# EAGLE schematic main (EAGLE 9.4.2), part 1 of 2

## Sheet 1 of 11: Clock & Power
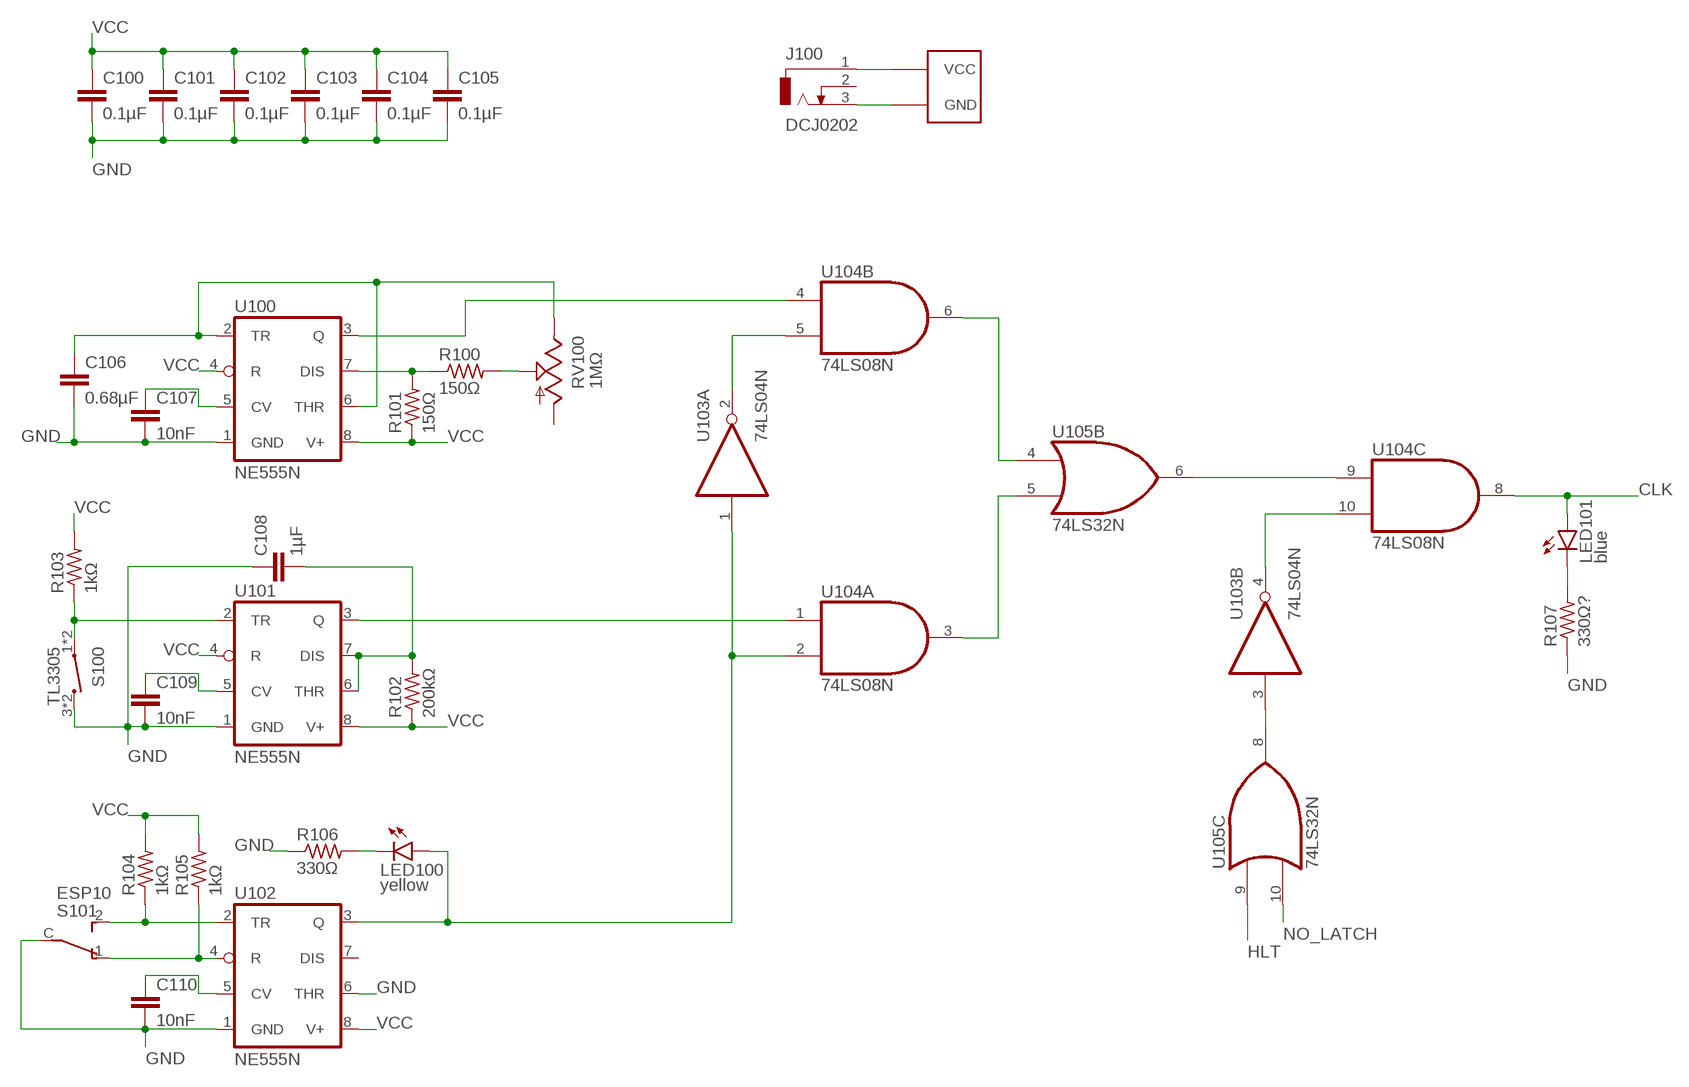
[diagram p0: schematic, sheet 1]

### Parts
C100  0.1µF  C-EUC0805K  [C0805K]
C101  0.1µF  C-EUC0805K  [C0805K]
C102  0.1µF  C-EUC0805K  [C0805K]
C103  0.1µF  C-EUC0805K  [C0805K]
C104  0.1µF  C-EUC0805K  [C0805K]
C105  0.1µF  C-EUC0805K  [C0805K]
C106  0.68µF  C-EUC0805K  [C0805K]
C107  10nF  C-EUC0805K  [C0805K]
C108  1µF  C-EUC0805K  [C0805K]
C109  10nF  C-EUC0805K  [C0805K]
C110  10nF  C-EUC0805K  [C0805K]
J100  DCJ0202  [DCJ0202]
LED100  yellow  LED3MM  [LED3MM]
LED101  blue  LED3MM  [LED3MM]
R100  150Ω  R-US_R0805  [R0805]
R101  150Ω  R-US_R0805  [R0805]
R102  200kΩ  R-US_R0805  [R0805]
R103  1kΩ  R-US_R0805  [R0805]
R104  1kΩ  R-US_R0805  [R0805]
R105  1kΩ  R-US_R0805  [R0805]
R106  330Ω  R-US_R0805  [R0805]
R107  330Ω?  R-US_R0805  [R0805]
RV100  1MΩ  TRIM_US-CA9V  [CA9V]
S100  TL3305  [TL3305_MICROSWITCH]
S101  ESP10  [ESP10]
U100  NE555N  [DIL08]
U101  NE555N  [DIL08]
U102  NE555N  [DIL08]
U103  74LS04N  [DIL14]
U104  74LS08N  [DIL14]
U105  74LS32N  [DIL14]

### Nets
!CLK_ENABLE: U103.3(B:I) U105.8(C:O)
!CLK_SWITCH: U103.2(A:O) U104.5(B:I1)
CLK: LED101.A U104.8(C:O) ; also sheet 2,3,4,5,6,7,9,10,11
CLK_AUTO: U104.6(B:O) U105.4(B:I0)
CLK_AUTO_RAW: U100.3(Q) U104.4(B:I0)
CLK_ENABLE: U103.4(B:O) U104.10(C:I1)
CLK_MANUAL: U104.3(A:O) U105.5(B:I1)
CLK_MANUAL_RAW: U101.3(Q) U104.1(A:I0)
CLK_RAW: U104.9(C:I0) U105.6(B:O)
CLK_SWITCH: LED100.A U102.3(Q) U103.1(A:I) U104.2(A:I1)
GND: C100.2 C101.2 C102.2 C103.2 C104.2 C105.2 C106.2 C107.2 C108.1 C109.2 C110.2 J100.3 R106.1 R107.1 S100.3 S100.4 S101.C(P) U100.1(GND) U101.1(GND) U102.1(GND) U102.6(THR) ; supply symbol labelled SUPPLY ; also sheet 2,3,4,5,6,7,8,9,10,11
HLT: U105.9(C:I0) ; also sheet 11
LED100_GND: LED100.K(C) R106.2
LED101_GND: LED101.K(C) R107.2
NO_LATCH: U105.10(C:I1) ; also sheet 5
U100_CAP: C106.1 RV100.E U100.2(TR) U100.6(THR)
U100_CV: C107.1 U100.5(CV)
U100_DIS: R100.1 R101.2 U100.7(DIS)
U100_DIS_INT: R100.2 RV100.S
U101_CAP: C108.2 R102.2 U101.6(THR) U101.7(DIS)
U101_CV: C109.1 U101.5(CV)
U101_TR: R103.1 S100.1 S100.2 U101.2(TR)
U102_CV: C110.1 U102.5(CV)
U102_R: R105.1 S101.1(O) U102.4(R)
U102_TR: R104.1 S101.2(S) U102.2(TR)
VCC: C100.1 C101.1 C102.1 C103.1 C104.1 C105.1 J100.1 R101.1 R102.1 R103.2 R104.2 R105.2 U100.4(R) U100.8(V+) U101.4(R) U101.8(V+) U102.8(V+) ; supply symbol labelled SUPPLY ; also sheet 2,3,4,5,6,7,8,9,10,11
Unconnected: J100.2 RV100.A U102.7(DIS) U103.5(C:I) U103.6(C:O) U103.12(F:O) U103.13(F:I) U104.11(D:O) U104.12(D:I0) U104.13(D:I1)

## Sheet 2 of 11: RAM & Z Register
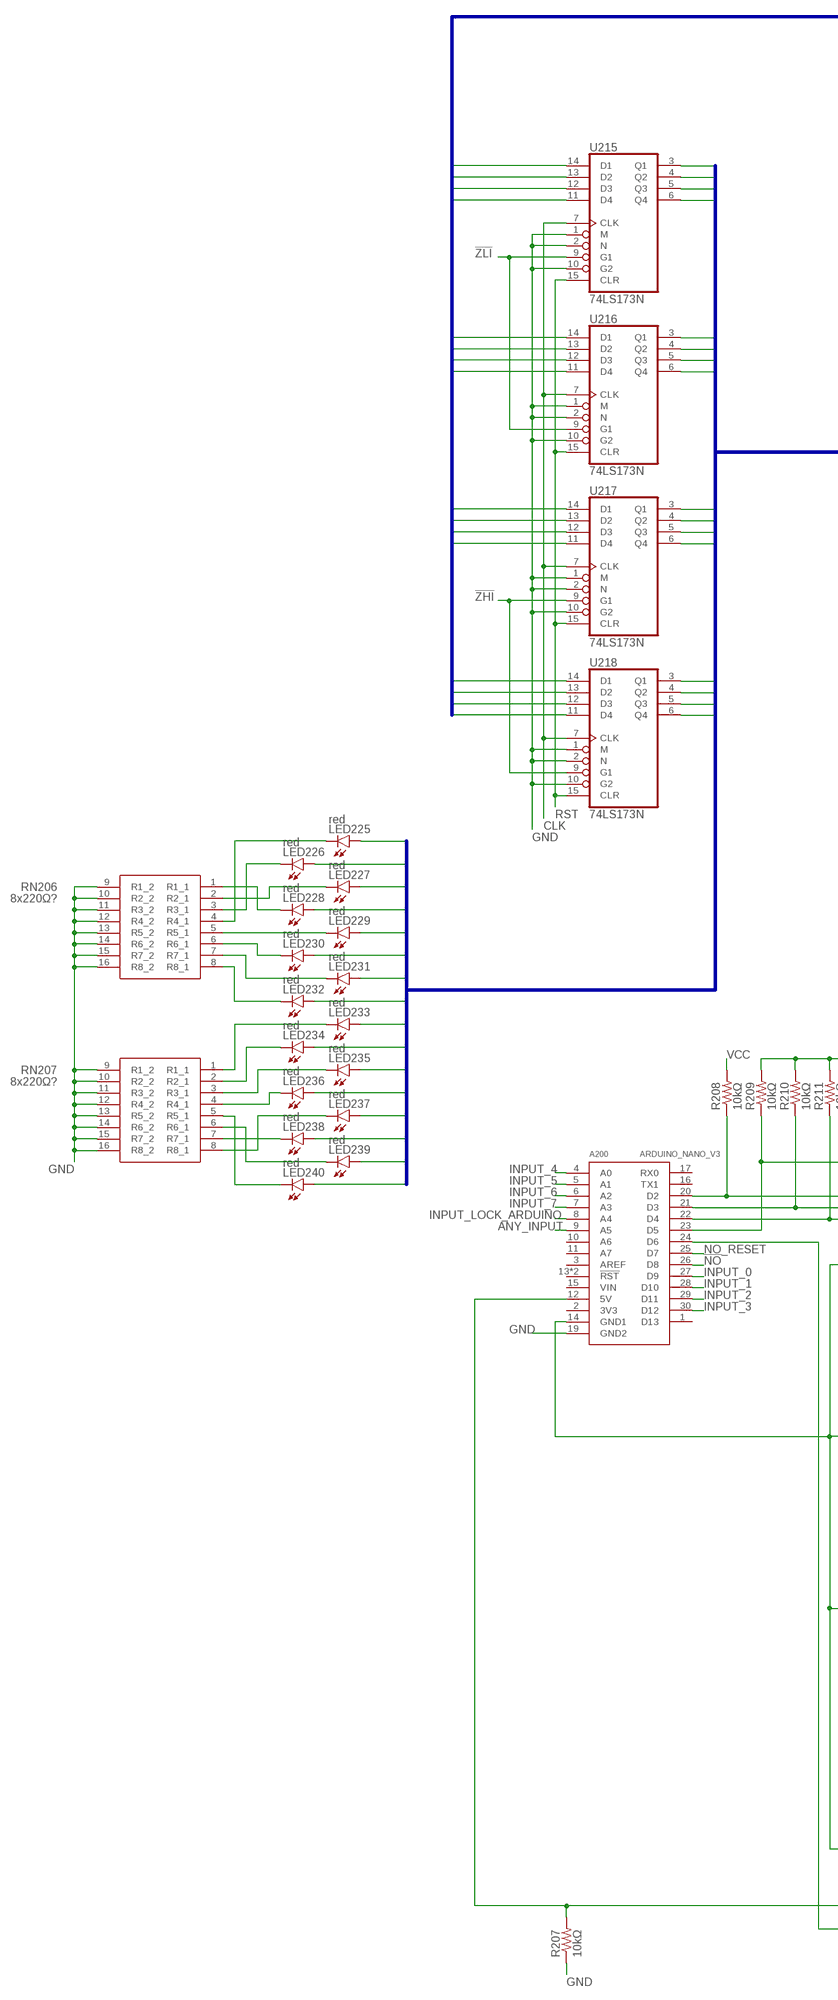
[diagram p1: schematic, sheet 2, part 1 of 2]
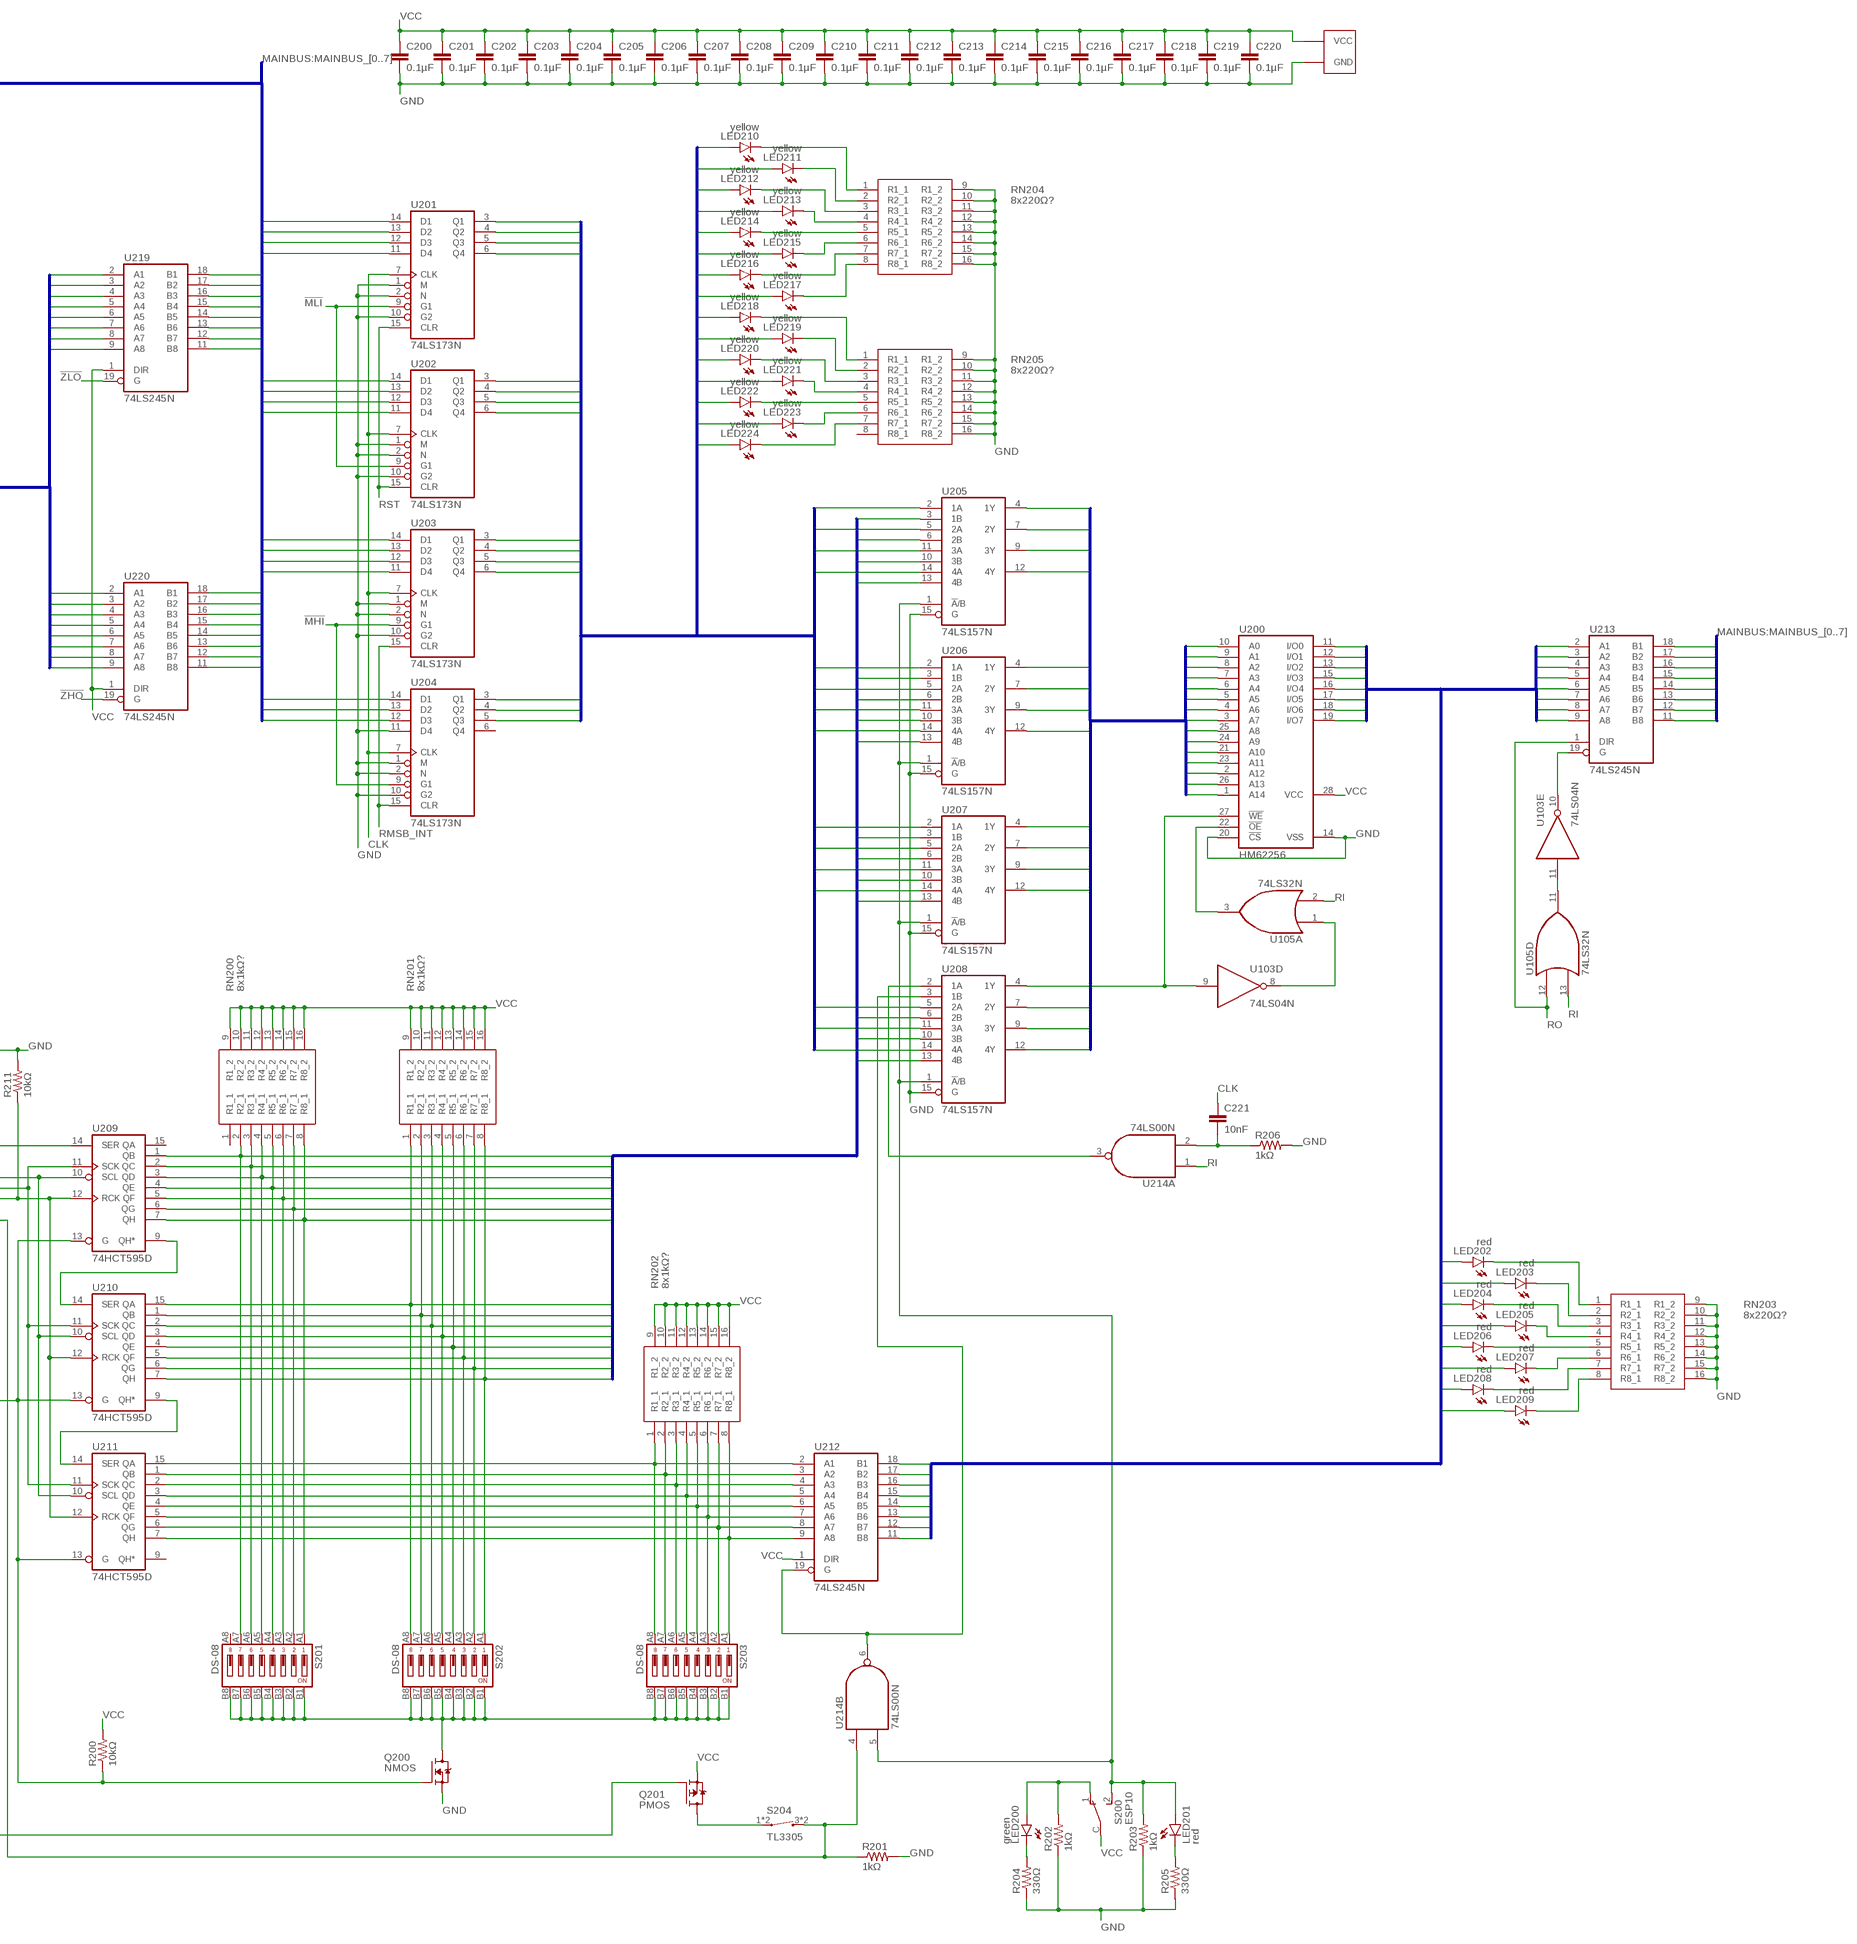
[diagram p2: schematic, sheet 2, part 2 of 2]

### Parts
A200  ARDUINO_NANO_V3  [ARDUINO_NANO_V3]
C200  0.1µF  C-EUC0805K  [C0805K]
C201  0.1µF  C-EUC0805K  [C0805K]
C202  0.1µF  C-EUC0805K  [C0805K]
C203  0.1µF  C-EUC0805K  [C0805K]
C204  0.1µF  C-EUC0805K  [C0805K]
C205  0.1µF  C-EUC0805K  [C0805K]
C206  0.1µF  C-EUC0805K  [C0805K]
C207  0.1µF  C-EUC0805K  [C0805K]
C208  0.1µF  C-EUC0805K  [C0805K]
C209  0.1µF  C-EUC0805K  [C0805K]
C210  0.1µF  C-EUC0805K  [C0805K]
C211  0.1µF  C-EUC0805K  [C0805K]
C212  0.1µF  C-EUC0805K  [C0805K]
C213  0.1µF  C-EUC0805K  [C0805K]
C214  0.1µF  C-EUC0805K  [C0805K]
C215  0.1µF  C-EUC0805K  [C0805K]
C216  0.1µF  C-EUC0805K  [C0805K]
C217  0.1µF  C-EUC0805K  [C0805K]
C218  0.1µF  C-EUC0805K  [C0805K]
C219  0.1µF  C-EUC0805K  [C0805K]
C220  0.1µF  C-EUC0805K  [C0805K]
C221  10nF  C-EUC0805K  [C0805K]
LED200  green  LED3MM  [LED3MM]
LED201  red  LED3MM  [LED3MM]
LED202  red  LED3MM  [LED3MM]
LED203  red  LED3MM  [LED3MM]
LED204  red  LED3MM  [LED3MM]
LED205  red  LED3MM  [LED3MM]
LED206  red  LED3MM  [LED3MM]
LED207  red  LED3MM  [LED3MM]
LED208  red  LED3MM  [LED3MM]
LED209  red  LED3MM  [LED3MM]
LED210  yellow  LED3MM  [LED3MM]
LED211  yellow  LED3MM  [LED3MM]
LED212  yellow  LED3MM  [LED3MM]
LED213  yellow  LED3MM  [LED3MM]
LED214  yellow  LED3MM  [LED3MM]
LED215  yellow  LED3MM  [LED3MM]
LED216  yellow  LED3MM  [LED3MM]
LED217  yellow  LED3MM  [LED3MM]
LED218  yellow  LED3MM  [LED3MM]
LED219  yellow  LED3MM  [LED3MM]
LED220  yellow  LED3MM  [LED3MM]
LED221  yellow  LED3MM  [LED3MM]
LED222  yellow  LED3MM  [LED3MM]
LED223  yellow  LED3MM  [LED3MM]
LED224  yellow  LED3MM  [LED3MM]
LED225  red  LED3MM  [LED3MM]
LED226  red  LED3MM  [LED3MM]
LED227  red  LED3MM  [LED3MM]
LED228  red  LED3MM  [LED3MM]
LED229  red  LED3MM  [LED3MM]
LED230  red  LED3MM  [LED3MM]
LED231  red  LED3MM  [LED3MM]
LED232  red  LED3MM  [LED3MM]
LED233  red  LED3MM  [LED3MM]
LED234  red  LED3MM  [LED3MM]
LED235  red  LED3MM  [LED3MM]
LED236  red  LED3MM  [LED3MM]
LED237  red  LED3MM  [LED3MM]
LED238  red  LED3MM  [LED3MM]
LED239  red  LED3MM  [LED3MM]
LED240  red  LED3MM  [LED3MM]
Q200  NMOS  SOT23-N-MOSFET  [SOT23]
Q201  PMOS  SOT23-P-MOSFET  [SOT23]
R200  10kΩ  R-US_R0805  [R0805]
R201  1kΩ  R-US_R0805  [R0805]
R202  1kΩ  R-US_R0805  [R0805]
R203  1kΩ  R-US_R0805  [R0805]
R204  330Ω  R-US_R0805  [R0805]
R205  330Ω  R-US_R0805  [R0805]
R206  1kΩ  R-US_R0805  [R0805]
R207  10kΩ  R-US_R0805  [R0805]
R208  10kΩ  R-US_R0805  [R0805]
R209  10kΩ  R-US_R0805  [R0805]
R210  10kΩ  R-US_R0805  [R0805]
R211  10kΩ  R-US_R0805  [R0805]
RN200  8x1kΩ?  CAY16-102J8LF  [CAY16102J8LF]
RN201  8x1kΩ?  CAY16-102J8LF  [CAY16102J8LF]
RN202  8x1kΩ?  CAY16-102J8LF  [CAY16102J8LF]
RN203  8x220Ω?  CAY16-102J8LF  [CAY16102J8LF]
RN204  8x220Ω?  CAY16-102J8LF  [CAY16102J8LF]
RN205  8x220Ω?  CAY16-102J8LF  [CAY16102J8LF]
RN206  8x220Ω?  CAY16-102J8LF  [CAY16102J8LF]
RN207  8x220Ω?  CAY16-102J8LF  [CAY16102J8LF]
S200  ESP10  [ESP10]
S201  DS-08  [DIPSW-08]
S202  DS-08  [DIPSW-08]
S203  DS-08  [DIPSW-08]
S204  TL3305  [TL3305_MICROSWITCH]
U200  HM62256  62256P  [DIL28-6]
U201  74LS173N  [DIL16]
U202  74LS173N  [DIL16]
U203  74LS173N  [DIL16]
U204  74LS173N  [DIL16]
U205  74LS157N  [DIL16]
U206  74LS157N  [DIL16]
U207  74LS157N  [DIL16]
U208  74LS157N  [DIL16]
U209  74HCT595D  74LS595D  [SO16]
U210  74HCT595D  74LS595D  [SO16]
U211  74HCT595D  74LS595D  [SO16]
U212  74LS245N  [DIL20]
U213  74LS245N  [DIL20]
U214  74LS00N  [DIL14]
U215  74LS173N  [DIL16]
U216  74LS173N  [DIL16]
U217  74LS173N  [DIL16]
U218  74LS173N  [DIL16]
U219  74LS245N  [DIL20]
U220  74LS245N  [DIL20]

### Nets
!MEM_IO_EN: U103.10(E:O) U213.19(G)
!MEM_MANMODE: LED200.A R202.2 S200.1(O)
!MHI: U203.9(G1) U204.9(G1) ; also sheet 11
!MLI: U201.9(G1) U202.9(G1) ; also sheet 11
!NO: A200.26(D8) ; also sheet 5,11
!ZHI: U217.9(G1) U218.9(G1) ; also sheet 11
!ZHO: U220.19(G) ; also sheet 11
!ZLI: U215.9(G1) U216.9(G1) ; also sheet 11
!ZLO: U219.19(G) ; also sheet 11
ANY_INPUT: A200.9(A5) ; also sheet 5,11
ARDUINO_5V_SENSE: A200.12(5V) Q201.1(G) R207.2
ARDUINO_DETECT_GND: A200.14(GND1) Q200.1(G) R200.1 U209.13(G) U210.13(G) U211.13(G)
ARDUINO_SR_CHAIN1: U209.9(QH*) U210.14(SER)
ARDUINO_SR_CHAIN2: U210.9(QH*) U211.14(SER)
ARDUINO_SR_CLK: A200.21(D3) R210.1 U209.11(SCK) U210.11(SCK) U211.11(SCK)
ARDUINO_SR_CLR: A200.20(D2) R208.1 U209.10(SCL) U210.10(SCL) U211.10(SCL)
ARDUINO_SR_DATA: A200.23(D5) R209.1 U209.14(SER)
ARDUINO_SR_PUSH: A200.22(D4) R211.1 U209.12(RCK) U210.12(RCK) U211.12(RCK)
CLK: C221.1 U201.7(CLK) U202.7(CLK) U203.7(CLK) U204.7(CLK) U215.7(CLK) U216.7(CLK) U217.7(CLK) U218.7(CLK) ; also sheet 1,3,4,5,6,7,9,10,11
GND: A200.19(GND2) C200.2 C201.2 C202.2 C203.2 C204.2 C205.2 C206.2 C207.2 C208.2 C209.2 C210.2 C211.2 C212.2 C213.2 C214.2 C215.2 C216.2 C217.2 C218.2 C219.2 C220.2 Q200.2(S) R201.2 R202.1 R203.1 R204.1 R205.1 R206.2 R207.1 R209.2 R210.2 R211.2 RN203.9(R1_2) RN203.10(R2_2) RN203.11(R3_2) RN203.12(R4_2) RN203.13(R5_2) RN203.14(R6_2) RN203.15(R7_2) RN203.16(R8_2) RN204.9(R1_2) RN204.10(R2_2) RN204.11(R3_2) RN204.12(R4_2) RN204.13(R5_2) RN204.14(R6_2) RN204.15(R7_2) RN204.16(R8_2) RN205.9(R1_2) RN205.10(R2_2) RN205.11(R3_2) RN205.12(R4_2) RN205.13(R5_2) RN205.14(R6_2) RN205.15(R7_2) RN205.16(R8_2) RN206.9(R1_2) RN206.10(R2_2) RN206.11(R3_2) RN206.12(R4_2) RN206.13(R5_2) RN206.14(R6_2) RN206.15(R7_2) RN206.16(R8_2) RN207.9(R1_2) RN207.10(R2_2) RN207.11(R3_2) RN207.12(R4_2) RN207.13(R5_2) RN207.14(R6_2) RN207.15(R7_2) RN207.16(R8_2) U200.14(VSS) U200.20(!CS) U201.1(M) U201.2(N) U201.10(G2) U202.1(M) U202.2(N) U202.10(G2) U203.1(M) U203.2(N) U203.10(G2) U204.1(M) U204.2(N) U204.10(G2) U204.11(D4) U205.15(G) U206.15(G) U207.15(G) U208.15(G) U215.1(M) U215.2(N) U215.10(G2) U216.1(M) U216.2(N) U216.10(G2) U217.1(M) U217.2(N) U217.10(G2) U218.1(M) U218.2(N) U218.10(G2) ; supply symbol labelled SUPPLY ; also sheet 1,3,4,5,6,7,8,9,10,11
INPUT_0: A200.27(D9) ; also sheet 5
INPUT_1: A200.28(D10) ; also sheet 5
INPUT_2: A200.29(D11) ; also sheet 5
INPUT_3: A200.30(D12) ; also sheet 5
INPUT_4: A200.4(A0) ; also sheet 5
INPUT_5: A200.5(A1) ; also sheet 5
INPUT_6: A200.6(A2) ; also sheet 5
INPUT_7: A200.7(A3) ; also sheet 5
INPUT_LOCK_ARDUINO: A200.8(A4) ; also sheet 5
LED202_GND: LED202.K(C) RN203.1(R1_1)
LED203_GND: LED203.K(C) RN203.2(R2_1)
LED204_GND: LED204.K(C) RN203.3(R3_1)
LED205_GND: LED205.K(C) RN203.4(R4_1)
LED206_GND: LED206.K(C) RN203.5(R5_1)
LED207_GND: LED207.K(C) RN203.6(R6_1)
LED208_GND: LED208.K(C) RN203.7(R7_1)
LED209_GND: LED209.K(C) RN203.8(R8_1)
LED210_GND: LED210.K(C) RN204.1(R1_1)
LED211_GND: LED211.K(C) RN204.2(R2_1)
LED212_GND: LED212.K(C) RN204.3(R3_1)
LED213_GND: LED213.K(C) RN204.4(R4_1)
LED214_GND: LED214.K(C) RN204.5(R5_1)
LED215_GND: LED215.K(C) RN204.6(R6_1)
LED216_GND: LED216.K(C) RN204.7(R7_1)
LED217_GND: LED217.K(C) RN204.8(R8_1)
LED218_GND: LED218.K(C) RN205.1(R1_1)
LED219_GND: LED219.K(C) RN205.2(R2_1)
LED220_GND: LED220.K(C) RN205.3(R3_1)
LED221_GND: LED221.K(C) RN205.4(R4_1)
LED222_GND: LED222.K(C) RN205.5(R5_1)
LED223_GND: LED223.K(C) RN205.6(R6_1)
LED224_GND: LED224.K(C) RN205.7(R7_1)
LED225_GND: LED225.K(C) RN206.4(R4_1)
LED226_GND: LED226.K(C) RN206.3(R3_1)
LED227_GND: LED227.K(C) RN206.2(R2_1)
LED228_GND: LED228.K(C) RN206.1(R1_1)
LED229_GND: LED229.K(C) RN206.5(R5_1)
LED230_GND: LED230.K(C) RN206.6(R6_1)
LED231_GND: LED231.K(C) RN206.7(R7_1)
LED232_GND: LED232.K(C) RN206.8(R8_1)
LED233_GND: LED233.K(C) RN207.1(R1_1)
LED234_GND: LED234.K(C) RN207.2(R2_1)
LED235_GND: LED235.K(C) RN207.3(R3_1)
LED236_GND: LED236.K(C) RN207.4(R4_1)
LED237_GND: LED237.K(C) RN207.8(R8_1)
LED238_GND: LED238.K(C) RN207.7(R7_1)
LED239_GND: LED239.K(C) RN207.6(R6_1)
LED240_GND: LED240.K(C) RN207.5(R5_1)
MAINBUS_0: U201.14(D1) U203.14(D1) U213.18(B1) U215.14(D1) U217.14(D1) U219.18(B1) U220.18(B1) ; also sheet 3,4,5,6,7,8,9,10,11
MAINBUS_1: U201.13(D2) U203.13(D2) U213.17(B2) U215.13(D2) U217.13(D2) U219.17(B2) U220.17(B2) ; also sheet 3,4,5,6,7,8,9,10,11
MAINBUS_2: U201.12(D3) U203.12(D3) U213.16(B3) U215.12(D3) U217.12(D3) U219.16(B3) U220.16(B3) ; also sheet 3,4,5,6,7,8,9,10,11
MAINBUS_3: U201.11(D4) U203.11(D4) U213.15(B4) U215.11(D4) U217.11(D4) U219.15(B4) U220.15(B4) ; also sheet 3,4,5,6,7,8,9,10,11
MAINBUS_4: U202.14(D1) U204.14(D1) U213.14(B5) U216.14(D1) U218.14(D1) U219.14(B5) U220.14(B5) ; also sheet 3,4,5,6,7,8,9,10,11
MAINBUS_5: U202.13(D2) U204.13(D2) U213.13(B6) U216.13(D2) U218.13(D2) U219.13(B6) U220.13(B6) ; also sheet 3,4,5,6,7,8,9,10,11
MAINBUS_6: U202.12(D3) U204.12(D3) U213.12(B7) U216.12(D3) U218.12(D3) U219.12(B7) U220.12(B7) ; also sheet 3,4,5,6,7,8,9,10,11
MAINBUS_7: U202.11(D4) U213.11(B8) U216.11(D4) U218.11(D4) U219.11(B8) U220.11(B8) ; also sheet 3,4,5,6,7,8,9,10
MEM_!MANMODE!_LED: LED200.K(C) R204.2
MEM_!OE: U105.3(A:O) U200.22(!OE)
MEM_!OE_INT: U103.8(D:O) U105.1(A:I0)
MEM_!WE: U103.9(D:I) U200.27(!WE) U208.4(1Y)
MEM_!WE!_AUTO: U208.2(1A) U214.3(A:O)
MEM_!WE!_MAN: U208.3(1B) U212.19(G) U214.6(B:O)
MEM_CLK_PULSE: C221.2 R206.1 U214.2(A:I1)
MEM_IO_EN: U103.11(E:I) U105.11(D:O)
MEM_MAN_GND: Q200.3(D) S201.B1 S201.B2 S201.B3 S201.B4 S201.B5 S201.B6 S201.B7 S201.B8 S202.B1 S202.B2 S202.B3 S202.B4 S202.B5 S202.B6 S202.B7 S202.B8 S203.B1 S203.B2 S203.B3 S203.B4 S203.B5 S203.B6 S203.B7 S203.B8
MEM_MAN_VCC: Q201.3(D) S204.1 S204.2
MEM_MAN_WRITE: A200.24(D6) R201.1 S204.3 S204.4 U214.4(B:I0)
MEM_MANMODE: LED201.A R203.2 S200.2(S) U205.1(!A!/B) U206.1(!A!/B) U207.1(!A!/B) U208.1(!A!/B) U214.5(B:I1)
MEM_MANMODE_LED: LED201.K(C) R205.2
MEMADDR_0: U200.10(A0) U205.4(1Y)
MEMADDR_1: U200.9(A1) U205.7(2Y)
MEMADDR_2: U200.8(A2) U205.12(4Y)
MEMADDR_3: U200.7(A3) U205.9(3Y)
MEMADDR_4: U200.6(A4) U206.7(2Y)
MEMADDR_5: U200.5(A5) U206.4(1Y)
MEMADDR_6: U200.4(A6) U206.9(3Y)
MEMADDR_7: U200.3(A7) U206.12(4Y)
MEMADDR_8: U200.25(A8) U207.7(2Y)
MEMADDR_9: U200.24(A9) U207.4(1Y)
MEMADDR_10: U200.21(A10) U207.12(4Y)
MEMADDR_11: U200.23(A11) U207.9(3Y)
MEMADDR_12: U200.2(A12) U208.12(4Y)
MEMADDR_13: U200.26(A13) U208.7(2Y)
MEMADDR_14: U200.1(A14) U208.9(3Y)
MEMADDR_AUTO_0: LED210.A U201.3(Q1) U205.2(1A)
MEMADDR_AUTO_1: LED211.A U201.4(Q2) U205.5(2A)
MEMADDR_AUTO_2: LED212.A U201.5(Q3) U205.14(4A)
MEMADDR_AUTO_3: LED213.A U201.6(Q4) U205.11(3A)
MEMADDR_AUTO_4: LED214.A U202.3(Q1) U206.5(2A)
MEMADDR_AUTO_5: LED215.A U202.4(Q2) U206.2(1A)
MEMADDR_AUTO_6: LED216.A U202.5(Q3) U206.11(3A)
MEMADDR_AUTO_7: LED217.A U202.6(Q4) U206.14(4A)
MEMADDR_AUTO_8: LED218.A U203.3(Q1) U207.5(2A)
MEMADDR_AUTO_9: LED219.A U203.4(Q2) U207.2(1A)
MEMADDR_AUTO_10: LED220.A U203.5(Q3) U207.14(4A)
MEMADDR_AUTO_11: LED221.A U203.6(Q4) U207.11(3A)
MEMADDR_AUTO_12: LED222.A U204.3(Q1) U208.14(4A)
MEMADDR_AUTO_13: LED223.A U204.4(Q2) U208.5(2A)
MEMADDR_AUTO_14: LED224.A U204.5(Q3) U208.11(3A)
MEMADDR_MAN_0: RN201.8(R8_1) S202.A1 U205.3(1B) U210.7(QH)
MEMADDR_MAN_1: RN201.7(R7_1) S202.A2 U205.6(2B) U210.6(QG)
MEMADDR_MAN_2: RN201.6(R6_1) S202.A3 U205.13(4B) U210.5(QF)
MEMADDR_MAN_3: RN201.5(R5_1) S202.A4 U205.10(3B) U210.4(QE)
MEMADDR_MAN_4: RN201.4(R4_1) S202.A5 U206.6(2B) U210.3(QD)
MEMADDR_MAN_5: RN201.3(R3_1) S202.A6 U206.3(1B) U210.2(QC)
MEMADDR_MAN_6: RN201.2(R2_1) S202.A7 U206.10(3B) U210.1(QB)
MEMADDR_MAN_7: RN201.1(R1_1) S202.A8 U206.13(4B) U210.15(QA)
MEMADDR_MAN_8: RN200.8(R8_1) S201.A1 U207.6(2B) U209.7(QH)
MEMADDR_MAN_9: RN200.7(R7_1) S201.A2 U207.3(1B) U209.6(QG)
MEMADDR_MAN_10: RN200.6(R6_1) S201.A3 U207.13(4B) U209.5(QF)
MEMADDR_MAN_11: RN200.5(R5_1) S201.A4 U207.10(3B) U209.4(QE)
MEMADDR_MAN_12: RN200.4(R4_1) S201.A5 U208.13(4B) U209.3(QD)
MEMADDR_MAN_13: RN200.3(R3_1) S201.A6 U208.6(2B) U209.2(QC)
MEMADDR_MAN_14: RN200.2(R2_1) S201.A7 U208.10(3B) U209.1(QB)
MEMIO_0: LED202.A U200.11(I/O0) U212.11(B8) U213.2(A1)
MEMIO_1: LED203.A U200.12(I/O1) U212.12(B7) U213.3(A2)
MEMIO_2: LED204.A U200.13(I/O2) U212.13(B6) U213.4(A3)
MEMIO_3: LED205.A U200.15(I/O3) U212.14(B5) U213.5(A4)
MEMIO_4: LED206.A U200.16(I/O4) U212.15(B4) U213.6(A5)
MEMIO_5: LED207.A U200.17(I/O5) U212.16(B3) U213.7(A6)
MEMIO_6: LED208.A U200.18(I/O6) U212.17(B2) U213.8(A7)
MEMIO_7: LED209.A U200.19(I/O7) U212.18(B1) U213.9(A8)
MEMIO_MAN_0: RN202.8(R8_1) S203.A1 U211.7(QH) U212.9(A8)
MEMIO_MAN_1: RN202.7(R7_1) S203.A2 U211.6(QG) U212.8(A7)
MEMIO_MAN_2: RN202.6(R6_1) S203.A3 U211.5(QF) U212.7(A6)
MEMIO_MAN_3: RN202.5(R5_1) S203.A4 U211.4(QE) U212.6(A5)
MEMIO_MAN_4: RN202.4(R4_1) S203.A5 U211.3(QD) U212.5(A4)
MEMIO_MAN_5: RN202.3(R3_1) S203.A6 U211.2(QC) U212.4(A3)
MEMIO_MAN_6: RN202.2(R2_1) S203.A7 U211.1(QB) U212.3(A2)
MEMIO_MAN_7: RN202.1(R1_1) S203.A8 U211.15(QA) U212.2(A1)
NO_RESET: A200.25(D7) ; also sheet 5
REG_Z_0: LED225.A U215.3(Q1) U219.2(A1)
REG_Z_1: LED226.A U215.4(Q2) U219.3(A2)
REG_Z_2: LED227.A U215.5(Q3) U219.4(A3)
REG_Z_3: LED228.A U215.6(Q4) U219.5(A4)
REG_Z_4: LED229.A U216.3(Q1) U219.6(A5)
REG_Z_5: LED230.A U216.4(Q2) U219.7(A6)
REG_Z_6: LED231.A U216.5(Q3) U219.8(A7)
REG_Z_7: LED232.A U216.6(Q4) U219.9(A8)
REG_Z_8: LED233.A U217.3(Q1) U220.2(A1)
REG_Z_9: LED234.A U217.4(Q2) U220.3(A2)
REG_Z_10: LED235.A U217.5(Q3) U220.4(A3)
REG_Z_11: LED236.A U217.6(Q4) U220.5(A4)
REG_Z_12: LED237.A U218.3(Q1) U220.6(A5)
REG_Z_13: LED238.A U218.4(Q2) U220.7(A6)
REG_Z_14: LED239.A U218.5(Q3) U220.8(A7)
REG_Z_15: LED240.A U218.6(Q4) U220.9(A8)
RI: U105.2(A:I1) U105.13(D:I1) U214.1(A:I0) ; also sheet 11
RMSB_INT: U203.15(CLR) U204.15(CLR) ; also sheet 3
RO: U105.12(D:I0) U213.1(DIR) ; also sheet 11
RST: U201.15(CLR) U202.15(CLR) U215.15(CLR) U216.15(CLR) U217.15(CLR) U218.15(CLR) ; also sheet 3,5,6,7,9,10,11
VCC: C200.1 C201.1 C202.1 C203.1 C204.1 C205.1 C206.1 C207.1 C208.1 C209.1 C210.1 C211.1 C212.1 C213.1 C214.1 C215.1 C216.1 C217.1 C218.1 C219.1 C220.1 Q201.2(S) R200.2 R208.2 RN200.9(R1_2) RN200.10(R2_2) RN200.11(R3_2) RN200.12(R4_2) RN200.13(R5_2) RN200.14(R6_2) RN200.15(R7_2) RN200.16(R8_2) RN201.9(R1_2) RN201.10(R2_2) RN201.11(R3_2) RN201.12(R4_2) RN201.13(R5_2) RN201.14(R6_2) RN201.15(R7_2) RN201.16(R8_2) RN202.9(R1_2) RN202.10(R2_2) RN202.11(R3_2) RN202.12(R4_2) RN202.13(R5_2) RN202.14(R6_2) RN202.15(R7_2) RN202.16(R8_2) S200.C(P) U200.28(VCC) U212.1(DIR) U219.1(DIR) U220.1(DIR) ; supply symbol labelled SUPPLY ; also sheet 1,3,4,5,6,7,8,9,10,11
Unconnected: A200.1(D13) A200.2(3V3) A200.3(AREF) A200.10(A6) A200.11(A7) A200.13(!RST) A200.15(VIN) A200.16(TX1) A200.17(RX0) A200.18(!RST) RN200.1(R1_1) RN205.8(R8_1) S201.A8 U204.6(Q4) U209.15(QA) U211.9(QH*) U214.11(D:O) U214.12(D:I0) U214.13(D:I1)

### Buses
MEMADDR_AUTO:MEMADDR_AUTO_[0..14]
MAINBUS:MAINBUS_[0..7]
MEMADDR_MAN:MEMADDR_MAN_[0..14]
MEMADDR:MEMADDR_[0..14]
MEMIO:MEMIO_[0..7]
REG_Z:REG_Z_[0..15]

## Sheet 3 of 11: Shift Register, Bus & Reset
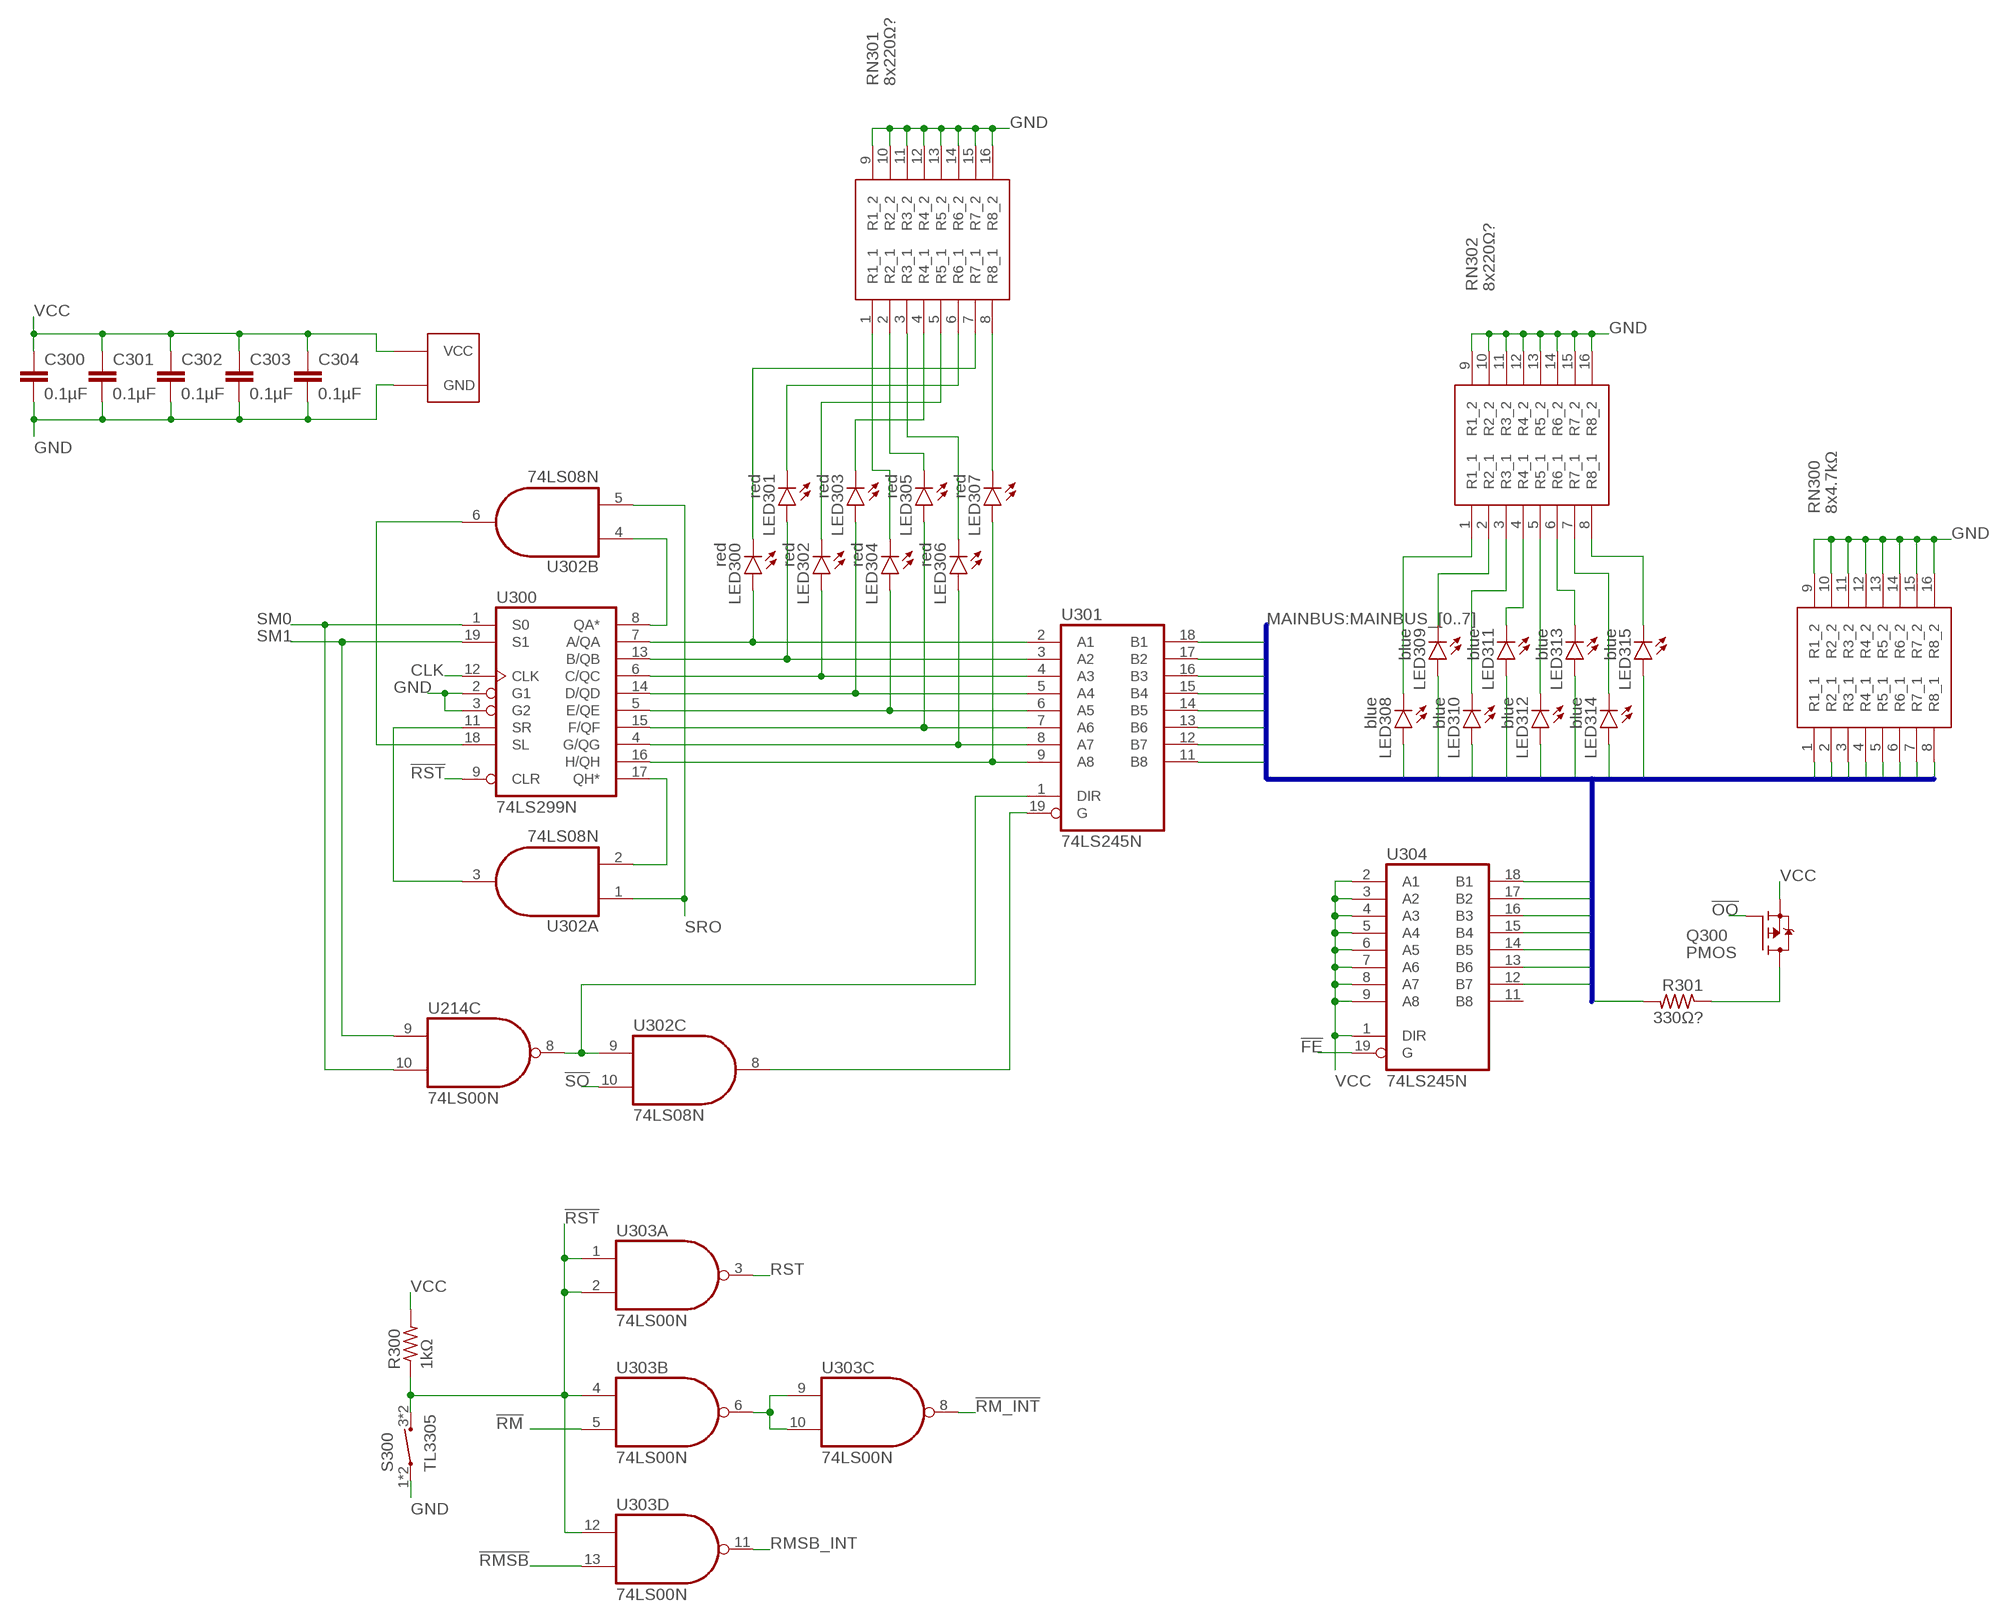
[diagram p3: schematic, sheet 3]

### Parts
C300  0.1µF  C-EUC0805K  [C0805K]
C301  0.1µF  C-EUC0805K  [C0805K]
C302  0.1µF  C-EUC0805K  [C0805K]
C303  0.1µF  C-EUC0805K  [C0805K]
C304  0.1µF  C-EUC0805K  [C0805K]
LED300  red  LED3MM  [LED3MM]
LED301  red  LED3MM  [LED3MM]
LED302  red  LED3MM  [LED3MM]
LED303  red  LED3MM  [LED3MM]
LED304  red  LED3MM  [LED3MM]
LED305  red  LED3MM  [LED3MM]
LED306  red  LED3MM  [LED3MM]
LED307  red  LED3MM  [LED3MM]
LED308  blue  LED3MM  [LED3MM]
LED309  blue  LED3MM  [LED3MM]
LED310  blue  LED3MM  [LED3MM]
LED311  blue  LED3MM  [LED3MM]
LED312  blue  LED3MM  [LED3MM]
LED313  blue  LED3MM  [LED3MM]
LED314  blue  LED3MM  [LED3MM]
LED315  blue  LED3MM  [LED3MM]
Q300  PMOS  SOT23-P-MOSFET  [SOT23]
R300  1kΩ  R-US_R0805  [R0805]
R301  330Ω?  R-US_R0805  [R0805]
RN300  8x4.7kΩ  CAY16-102J8LF  [CAY16102J8LF]
RN301  8x220Ω?  CAY16-102J8LF  [CAY16102J8LF]
RN302  8x220Ω?  CAY16-102J8LF  [CAY16102J8LF]
S300  TL3305  [TL3305_MICROSWITCH]
U300  74LS299N  [DIL20]
U301  74LS245N  [DIL20]
U302  74LS08N  [DIL14]
U303  74LS00N  [DIL14]
U304  74LS245N  [DIL20]

### Nets
!FE: U304.19(G) ; also sheet 11
!OO: Q300.1(G) ; also sheet 11
!RM: U303.5(B:I1) ; also sheet 11
!RM_INT: U303.8(C:O) ; also sheet 11
!RMSB: U303.13(D:I1) ; also sheet 11
!RST: R300.1 S300.3 S300.4 U300.9(CLR) U303.1(A:I0) U303.2(A:I1) U303.4(B:I0) U303.12(D:I0) ; also sheet 4
!SHIFT_IO_EN: U301.19(G) U302.8(C:O)
!SO: U302.10(C:I1) ; also sheet 11
BUS_OO: Q300.3(D) R301.1
CLK: U300.12(CLK) ; also sheet 1,2,4,5,6,7,9,10,11
GND: C300.2 C301.2 C302.2 C303.2 C304.2 RN300.9(R1_2) RN300.10(R2_2) RN300.11(R3_2) RN300.12(R4_2) RN300.13(R5_2) RN300.14(R6_2) RN300.15(R7_2) RN300.16(R8_2) RN301.9(R1_2) RN301.10(R2_2) RN301.11(R3_2) RN301.12(R4_2) RN301.13(R5_2) RN301.14(R6_2) RN301.15(R7_2) RN301.16(R8_2) RN302.9(R1_2) RN302.10(R2_2) RN302.11(R3_2) RN302.12(R4_2) RN302.13(R5_2) RN302.14(R6_2) RN302.15(R7_2) RN302.16(R8_2) S300.1 S300.2 U300.2(G1) U300.3(G2) ; supply symbol labelled SUPPLY ; also sheet 1,2,4,5,6,7,8,9,10,11
LED300_GND: LED300.K(C) RN301.7(R7_1)
LED301_GND: LED301.K(C) RN301.6(R6_1)
LED302_GND: LED302.K(C) RN301.5(R5_1)
LED303_GND: LED303.K(C) RN301.4(R4_1)
LED304_GND: LED304.K(C) RN301.1(R1_1)
LED305_GND: LED305.K(C) RN301.2(R2_1)
LED306_GND: LED306.K(C) RN301.3(R3_1)
LED307_GND: LED307.K(C) RN301.8(R8_1)
LED308_GND: LED308.K(C) RN302.1(R1_1)
LED309_GND: LED309.K(C) RN302.2(R2_1)
LED310_GND: LED310.K(C) RN302.3(R3_1)
LED311_GND: LED311.K(C) RN302.4(R4_1)
LED312_GND: LED312.K(C) RN302.5(R5_1)
LED313_GND: LED313.K(C) RN302.6(R6_1)
LED314_GND: LED314.K(C) RN302.7(R7_1)
LED315_GND: LED315.K(C) RN302.8(R8_1)
MAINBUS_0: LED315.A R301.2 RN300.8(R8_1) U301.11(B8) ; also sheet 2,4,5,6,7,8,9,10,11
MAINBUS_1: LED314.A RN300.7(R7_1) U301.12(B7) U304.12(B7) ; also sheet 2,4,5,6,7,8,9,10,11
MAINBUS_2: LED313.A RN300.6(R6_1) U301.13(B6) U304.13(B6) ; also sheet 2,4,5,6,7,8,9,10,11
MAINBUS_3: LED312.A RN300.5(R5_1) U301.14(B5) U304.14(B5) ; also sheet 2,4,5,6,7,8,9,10,11
MAINBUS_4: LED311.A RN300.4(R4_1) U301.15(B4) U304.15(B4) ; also sheet 2,4,5,6,7,8,9,10,11
MAINBUS_5: LED310.A RN300.3(R3_1) U301.16(B3) U304.16(B3) ; also sheet 2,4,5,6,7,8,9,10,11
MAINBUS_6: LED309.A RN300.2(R2_1) U301.17(B2) U304.17(B2) ; also sheet 2,4,5,6,7,8,9,10,11
MAINBUS_7: LED308.A RN300.1(R1_1) U301.18(B1) U304.18(B1) ; also sheet 2,4,5,6,7,8,9,10
RM_INT: U303.6(B:O) U303.9(C:I0) U303.10(C:I1)
RMSB_INT: U303.11(D:O) ; also sheet 2
RST: U303.3(A:O) ; also sheet 2,5,6,7,9,10,11
SHIFT_IO_0: LED307.A U300.16(H/QH) U301.9(A8)
SHIFT_IO_1: LED306.A U300.4(G/QG) U301.8(A7)
SHIFT_IO_2: LED305.A U300.15(F/QF) U301.7(A6)
SHIFT_IO_3: LED304.A U300.5(E/QE) U301.6(A5)
SHIFT_IO_4: LED303.A U300.14(D/QD) U301.5(A4)
SHIFT_IO_5: LED302.A U300.6(C/QC) U301.4(A3)
SHIFT_IO_6: LED301.A U300.13(B/QB) U301.3(A2)
SHIFT_IO_7: LED300.A U300.7(A/QA) U301.2(A1)
SHIFT_IO_DIR: U214.8(C:O) U301.1(DIR) U302.9(C:I0)
SHIFT_LEFT_FEEDBACK: U300.18(SL) U302.6(B:O)
SHIFT_LEFT_FEEDBACK_RAW: U300.8(QA*) U302.4(B:I0)
SHIFT_RIGHT_FEEDBACK: U300.11(SR) U302.3(A:O)
SHIFT_RIGHT_FEEDBACK_RAW: U300.17(QH*) U302.2(A:I1)
SM0: U214.10(C:I1) U300.1(S0) ; also sheet 11
SM1: U214.9(C:I0) U300.19(S1) ; also sheet 11
SRO: U302.1(A:I0) U302.5(B:I1) ; also sheet 11
VCC: C300.1 C301.1 C302.1 C303.1 C304.1 Q300.2(S) R300.2 U304.1(DIR) U304.2(A1) U304.3(A2) U304.4(A3) U304.5(A4) U304.6(A5) U304.7(A6) U304.8(A7) U304.9(A8) ; supply symbol labelled SUPPLY ; also sheet 1,2,4,5,6,7,8,9,10,11
Unconnected: U302.11(D:O) U302.12(D:I0) U302.13(D:I1) U304.11(B8)

### Buses
MAINBUS:MAINBUS_[0..7]

## Sheet 4 of 11: Program Counter
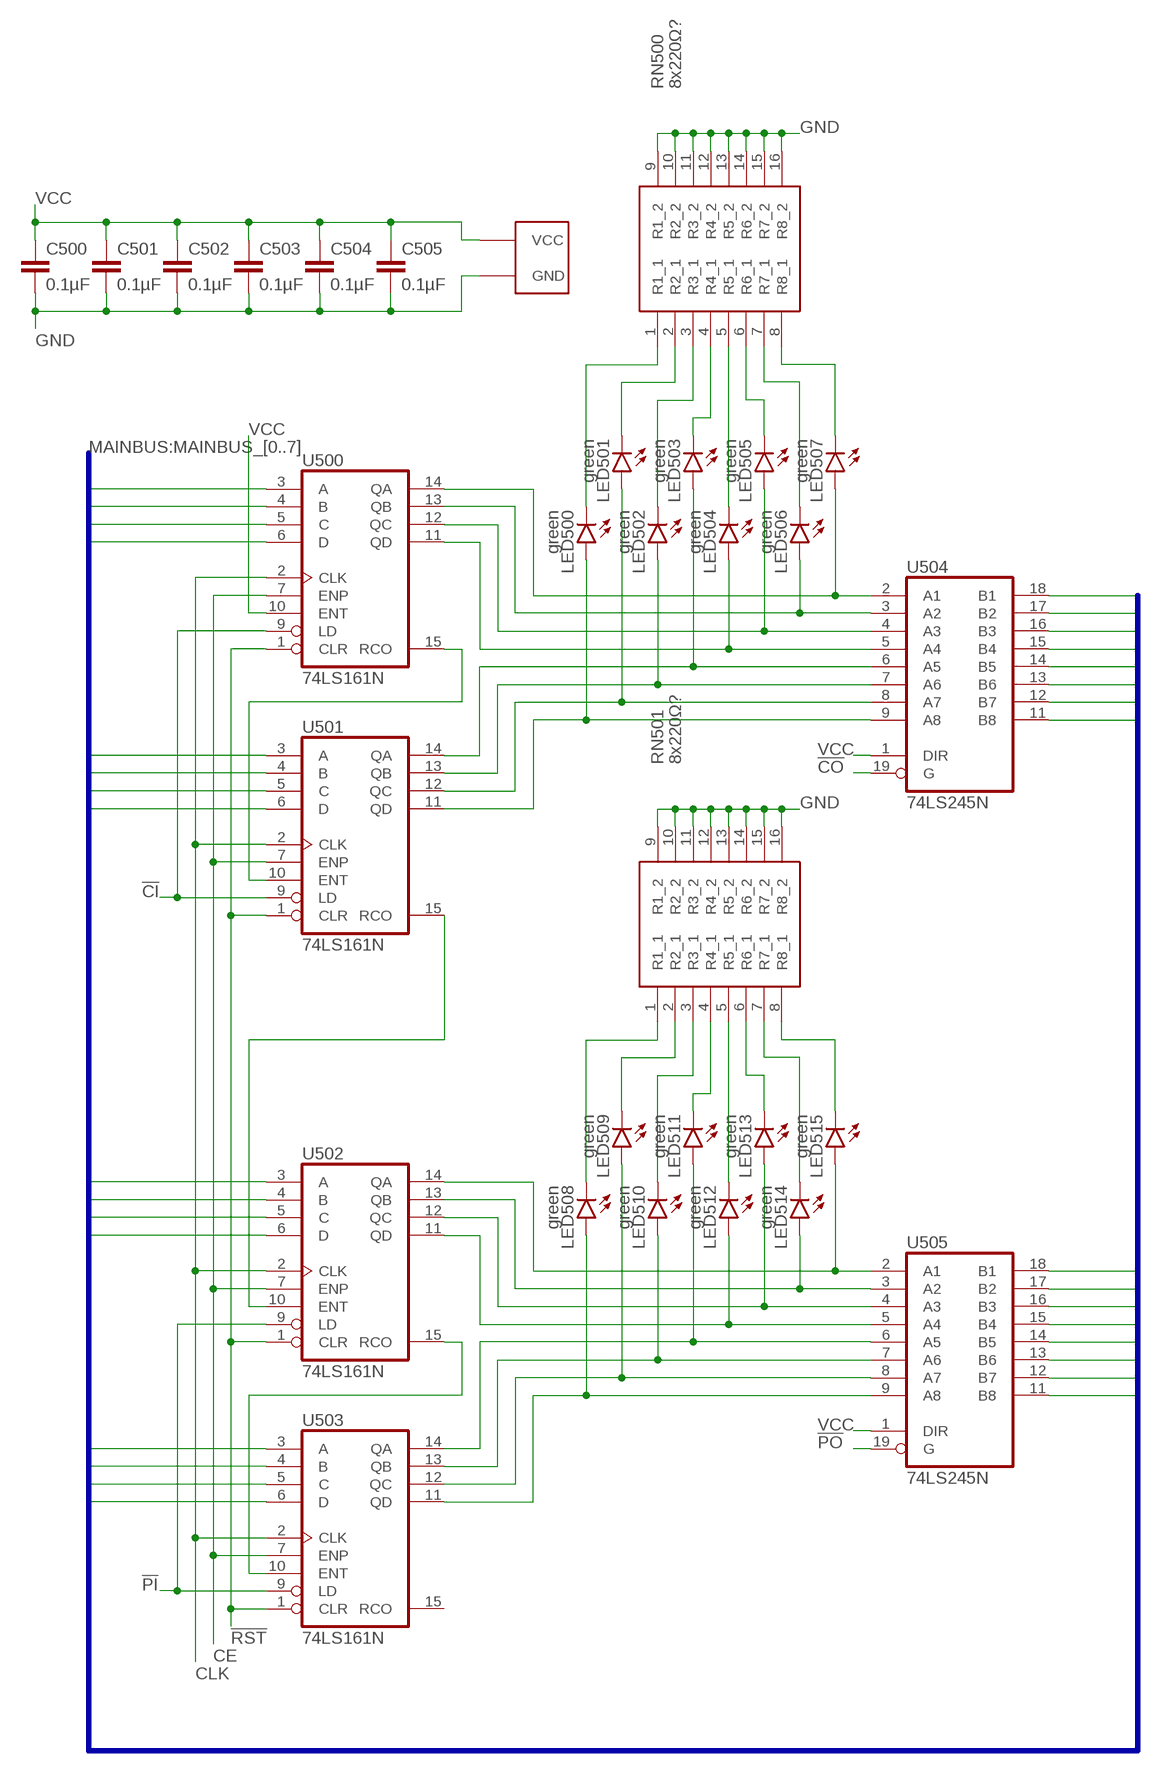
[diagram p4: schematic, sheet 4]

### Parts
C500  0.1µF  C-EUC0805K  [C0805K]
C501  0.1µF  C-EUC0805K  [C0805K]
C502  0.1µF  C-EUC0805K  [C0805K]
C503  0.1µF  C-EUC0805K  [C0805K]
C504  0.1µF  C-EUC0805K  [C0805K]
C505  0.1µF  C-EUC0805K  [C0805K]
LED500  green  LED3MM  [LED3MM]
LED501  green  LED3MM  [LED3MM]
LED502  green  LED3MM  [LED3MM]
LED503  green  LED3MM  [LED3MM]
LED504  green  LED3MM  [LED3MM]
LED505  green  LED3MM  [LED3MM]
LED506  green  LED3MM  [LED3MM]
LED507  green  LED3MM  [LED3MM]
LED508  green  LED3MM  [LED3MM]
LED509  green  LED3MM  [LED3MM]
LED510  green  LED3MM  [LED3MM]
LED511  green  LED3MM  [LED3MM]
LED512  green  LED3MM  [LED3MM]
LED513  green  LED3MM  [LED3MM]
LED514  green  LED3MM  [LED3MM]
LED515  green  LED3MM  [LED3MM]
RN500  8x220Ω?  CAY16-102J8LF  [CAY16102J8LF]
RN501  8x220Ω?  CAY16-102J8LF  [CAY16102J8LF]
U500  74LS161N  [DIL16]
U501  74LS161N  [DIL16]
U502  74LS161N  [DIL16]
U503  74LS161N  [DIL16]
U504  74LS245N  [DIL20]
U505  74LS245N  [DIL20]

### Nets
!CI: U500.9(LD) U501.9(LD) ; also sheet 11
!CO: U504.19(G) ; also sheet 11
!PI: U502.9(LD) U503.9(LD) ; also sheet 11
!PO: U505.19(G) ; also sheet 11
!RST: U500.1(CLR) U501.1(CLR) U502.1(CLR) U503.1(CLR) ; also sheet 3
CE: U500.7(ENP) U501.7(ENP) U502.7(ENP) U503.7(ENP) ; also sheet 11
CLK: U500.2(CLK) U501.2(CLK) U502.2(CLK) U503.2(CLK) ; also sheet 1,2,3,5,6,7,9,10,11
COUNTER_0: LED507.A U500.14(QA) U504.2(A1)
COUNTER_1: LED506.A U500.13(QB) U504.3(A2)
COUNTER_2: LED505.A U500.12(QC) U504.4(A3)
COUNTER_3: LED504.A U500.11(QD) U504.5(A4)
COUNTER_4: LED503.A U501.14(QA) U504.6(A5)
COUNTER_5: LED502.A U501.13(QB) U504.7(A6)
COUNTER_6: LED501.A U501.12(QC) U504.8(A7)
COUNTER_7: LED500.A U501.11(QD) U504.9(A8)
COUNTER_RIPPLE_1: U500.15(RCO) U501.10(ENT)
COUNTER_RIPPLE_2: U501.15(RCO) U502.10(ENT)
COUNTER_RIPPLE_3: U502.15(RCO) U503.10(ENT)
GND: C500.2 C501.2 C502.2 C503.2 C504.2 C505.2 RN500.9(R1_2) RN500.10(R2_2) RN500.11(R3_2) RN500.12(R4_2) RN500.13(R5_2) RN500.14(R6_2) RN500.15(R7_2) RN500.16(R8_2) RN501.9(R1_2) RN501.10(R2_2) RN501.11(R3_2) RN501.12(R4_2) RN501.13(R5_2) RN501.14(R6_2) RN501.15(R7_2) RN501.16(R8_2) ; supply symbol labelled SUPPLY ; also sheet 1,2,3,5,6,7,8,9,10,11
LED500_GND: LED500.K(C) RN500.1(R1_1)
LED501_GND: LED501.K(C) RN500.2(R2_1)
LED502_GND: LED502.K(C) RN500.3(R3_1)
LED503_GND: LED503.K(C) RN500.4(R4_1)
LED504_GND: LED504.K(C) RN500.5(R5_1)
LED505_GND: LED505.K(C) RN500.6(R6_1)
LED506_GND: LED506.K(C) RN500.7(R7_1)
LED507_GND: LED507.K(C) RN500.8(R8_1)
LED508_GND: LED508.K(C) RN501.1(R1_1)
LED509_GND: LED509.K(C) RN501.2(R2_1)
LED510_GND: LED510.K(C) RN501.3(R3_1)
LED511_GND: LED511.K(C) RN501.4(R4_1)
LED512_GND: LED512.K(C) RN501.5(R5_1)
LED513_GND: LED513.K(C) RN501.6(R6_1)
LED514_GND: LED514.K(C) RN501.7(R7_1)
LED515_GND: LED515.K(C) RN501.8(R8_1)
MAINBUS_0: U500.3(A) U502.3(A) U504.18(B1) U505.18(B1) ; also sheet 2,3,5,6,7,8,9,10,11
MAINBUS_1: U500.4(B) U502.4(B) U504.17(B2) U505.17(B2) ; also sheet 2,3,5,6,7,8,9,10,11
MAINBUS_2: U500.5(C) U502.5(C) U504.16(B3) U505.16(B3) ; also sheet 2,3,5,6,7,8,9,10,11
MAINBUS_3: U500.6(D) U502.6(D) U504.15(B4) U505.15(B4) ; also sheet 2,3,5,6,7,8,9,10,11
MAINBUS_4: U501.3(A) U503.3(A) U504.14(B5) U505.14(B5) ; also sheet 2,3,5,6,7,8,9,10,11
MAINBUS_5: U501.4(B) U503.4(B) U504.13(B6) U505.13(B6) ; also sheet 2,3,5,6,7,8,9,10,11
MAINBUS_6: U501.5(C) U503.5(C) U504.12(B7) U505.12(B7) ; also sheet 2,3,5,6,7,8,9,10,11
MAINBUS_7: U501.6(D) U503.6(D) U504.11(B8) U505.11(B8) ; also sheet 2,3,5,6,7,8,9,10
PAGE_0: LED515.A U502.14(QA) U505.2(A1)
PAGE_1: LED514.A U502.13(QB) U505.3(A2)
PAGE_2: LED513.A U502.12(QC) U505.4(A3)
PAGE_3: LED512.A U502.11(QD) U505.5(A4)
PAGE_4: LED511.A U503.14(QA) U505.6(A5)
PAGE_5: LED510.A U503.13(QB) U505.7(A6)
PAGE_6: LED509.A U503.12(QC) U505.8(A7)
PAGE_7: LED508.A U503.11(QD) U505.9(A8)
VCC: C500.1 C501.1 C502.1 C503.1 C504.1 C505.1 U500.10(ENT) U504.1(DIR) U505.1(DIR) ; supply symbol labelled SUPPLY ; also sheet 1,2,3,5,6,7,8,9,10,11
Unconnected: U503.15(RCO)

### Buses
MAINBUS:MAINBUS_[0..7]

## Sheet 5 of 11: User Input & LCD
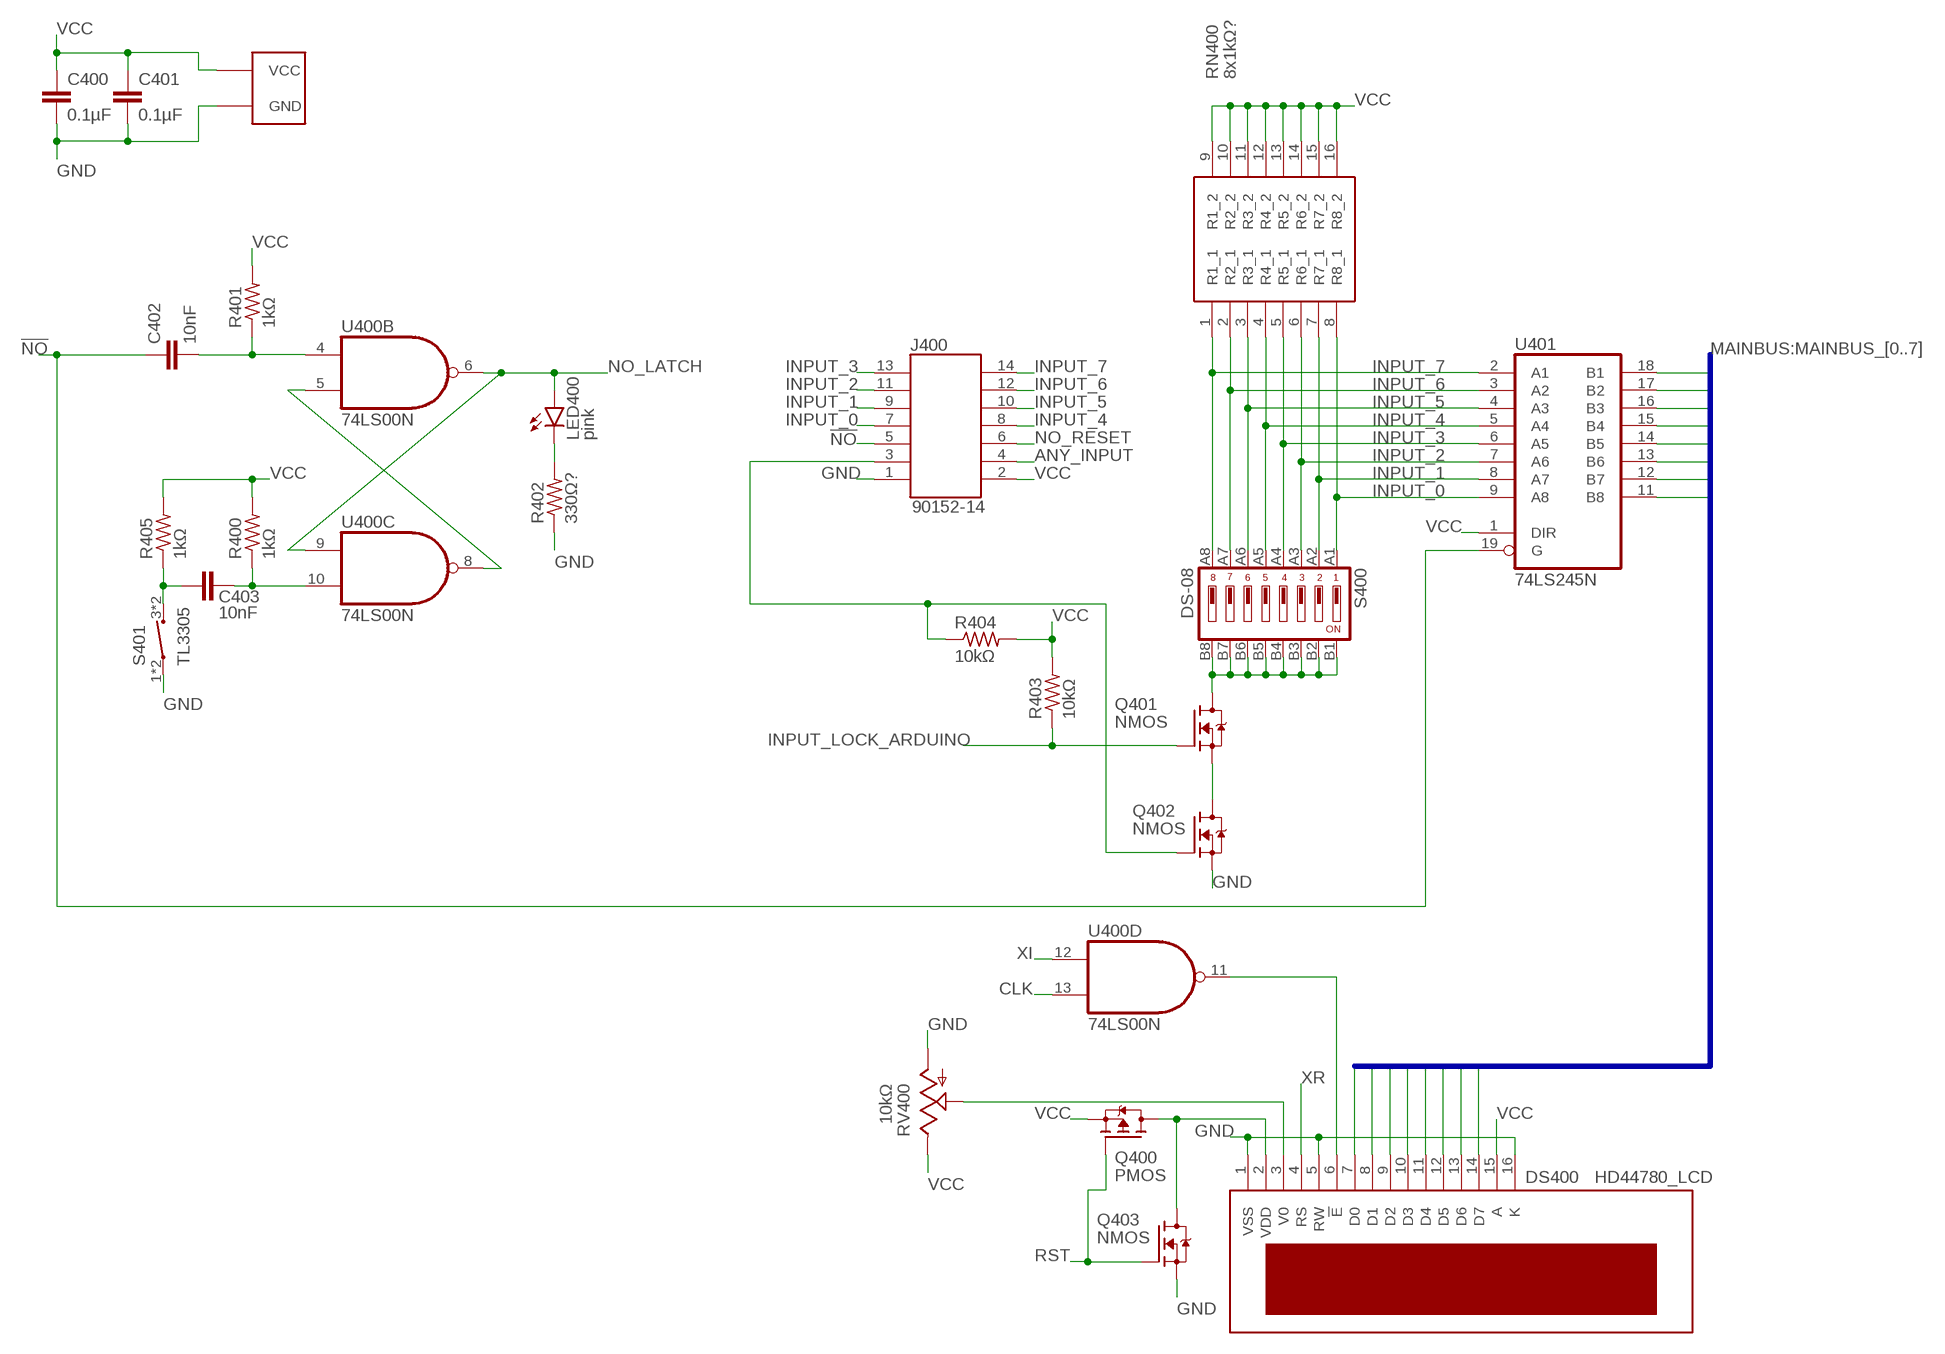
[diagram p5: schematic, sheet 5]

### Parts
C400  0.1µF  C-EUC0805K  [C0805K]
C401  0.1µF  C-EUC0805K  [C0805K]
C402  10nF  C-EUC0805K  [C0805K]
C403  10nF  C-EUC0805K  [C0805K]
DS400  HD44780_LCD  [HD44780_LCD]
J400  90152-14  [90152-14]
LED400  pink  LED3MM  [LED3MM]
Q400  PMOS  SOT23-P-MOSFET  [SOT23]
Q401  NMOS  SOT23-N-MOSFET  [SOT23]
Q402  NMOS  SOT23-N-MOSFET  [SOT23]
Q403  NMOS  SOT23-N-MOSFET  [SOT23]
R400  1kΩ  R-US_R0805  [R0805]
R401  1kΩ  R-US_R0805  [R0805]
R402  330Ω?  R-US_R0805  [R0805]
R403  10kΩ  R-US_R0805  [R0805]
R404  10kΩ  R-US_R0805  [R0805]
R405  1kΩ  R-US_R0805  [R0805]
RN400  8x1kΩ?  CAY16-102J8LF  [CAY16102J8LF]
RV400  10kΩ  TRIM_US-CA9V  [CA9V]
S400  DS-08  [DIPSW-08]
S401  TL3305  [TL3305_MICROSWITCH]
U400  74LS00N  [DIL14]
U401  74LS245N  [DIL20]

### Nets
!LCD_E: DS400.6(!E) U400.11(D:O)
!NO: C402.1 J400.5 U401.19(G) ; also sheet 2,11
!NO_LATCH: U400.5(B:I1) U400.8(C:O)
ANY_INPUT: J400.4 ; also sheet 2,11
CLK: U400.13(D:I1) ; also sheet 1,2,3,4,6,7,9,10,11
GND: C400.2 C401.2 DS400.1(VSS) DS400.5(RW) DS400.16(K) J400.1 Q402.2(S) Q403.2(S) R402.1 RV400.A S401.1 S401.2 ; supply symbol labelled SUPPLY ; also sheet 1,2,3,4,6,7,8,9,10,11
INPUT_0: J400.7 RN400.8(R8_1) S400.A1 U401.9(A8) ; also sheet 2
INPUT_1: J400.9 RN400.7(R7_1) S400.A2 U401.8(A7) ; also sheet 2
INPUT_2: J400.11 RN400.6(R6_1) S400.A3 U401.7(A6) ; also sheet 2
INPUT_3: J400.13 RN400.5(R5_1) S400.A4 U401.6(A5) ; also sheet 2
INPUT_4: J400.8 RN400.4(R4_1) S400.A5 U401.5(A4) ; also sheet 2
INPUT_5: J400.10 RN400.3(R3_1) S400.A6 U401.4(A3) ; also sheet 2
INPUT_6: J400.12 RN400.2(R2_1) S400.A7 U401.3(A2) ; also sheet 2
INPUT_7: J400.14 RN400.1(R1_1) S400.A8 U401.2(A1) ; also sheet 2
INPUT_GND: Q401.3(D) S400.B1 S400.B2 S400.B3 S400.B4 S400.B5 S400.B6 S400.B7 S400.B8
INPUT_GND_INT: Q401.2(S) Q402.3(D)
INPUT_LOCK_ARDUINO: Q401.1(G) R403.1 ; also sheet 2
INPUT_LOCK_EXT: J400.3 Q402.1(G) R404.1
LCD_V0: DS400.3(V0) RV400.S
LCD_VDD: DS400.2(VDD) Q400.3(D) Q403.3(D)
MAINBUS_0: DS400.7(D0) U401.11(B8) ; also sheet 2,3,4,6,7,8,9,10,11
MAINBUS_1: DS400.8(D1) U401.12(B7) ; also sheet 2,3,4,6,7,8,9,10,11
MAINBUS_2: DS400.9(D2) U401.13(B6) ; also sheet 2,3,4,6,7,8,9,10,11
MAINBUS_3: DS400.10(D3) U401.14(B5) ; also sheet 2,3,4,6,7,8,9,10,11
MAINBUS_4: DS400.11(D4) U401.15(B4) ; also sheet 2,3,4,6,7,8,9,10,11
MAINBUS_5: DS400.12(D5) U401.16(B3) ; also sheet 2,3,4,6,7,8,9,10,11
MAINBUS_6: DS400.13(D6) U401.17(B2) ; also sheet 2,3,4,6,7,8,9,10,11
MAINBUS_7: DS400.14(D7) U401.18(B1) ; also sheet 2,3,4,6,7,8,9,10
NO_LATCH: LED400.A U400.6(B:O) U400.9(C:I0) ; also sheet 1
NO_LED: LED400.K(C) R402.2
NO_RESET: C403.1 J400.6 R405.1 S401.3 S401.4 ; also sheet 2
NO_RESET_PULSE: C403.2 R400.1 U400.10(C:I1)
NO_SET_PULSE: C402.2 R401.1 U400.4(B:I0)
RST: Q400.1(G) Q403.1(G) ; also sheet 2,3,6,7,9,10,11
VCC: C400.1 C401.1 DS400.15(A) J400.2 Q400.2(S) R400.2 R401.2 R403.2 R404.2 R405.2 RN400.9(R1_2) RN400.10(R2_2) RN400.11(R3_2) RN400.12(R4_2) RN400.13(R5_2) RN400.14(R6_2) RN400.15(R7_2) RN400.16(R8_2) RV400.E U401.1(DIR) ; supply symbol labelled SUPPLY ; also sheet 1,2,3,4,6,7,8,9,10,11
XI: U400.12(D:I0) ; also sheet 11
XR: DS400.4(RS) ; also sheet 11
Unconnected: U400.1(A:I0) U400.2(A:I1) U400.3(A:O)

### Buses
MAINBUS:MAINBUS_[0..7]

## Sheet 6 of 11: A & B Registers
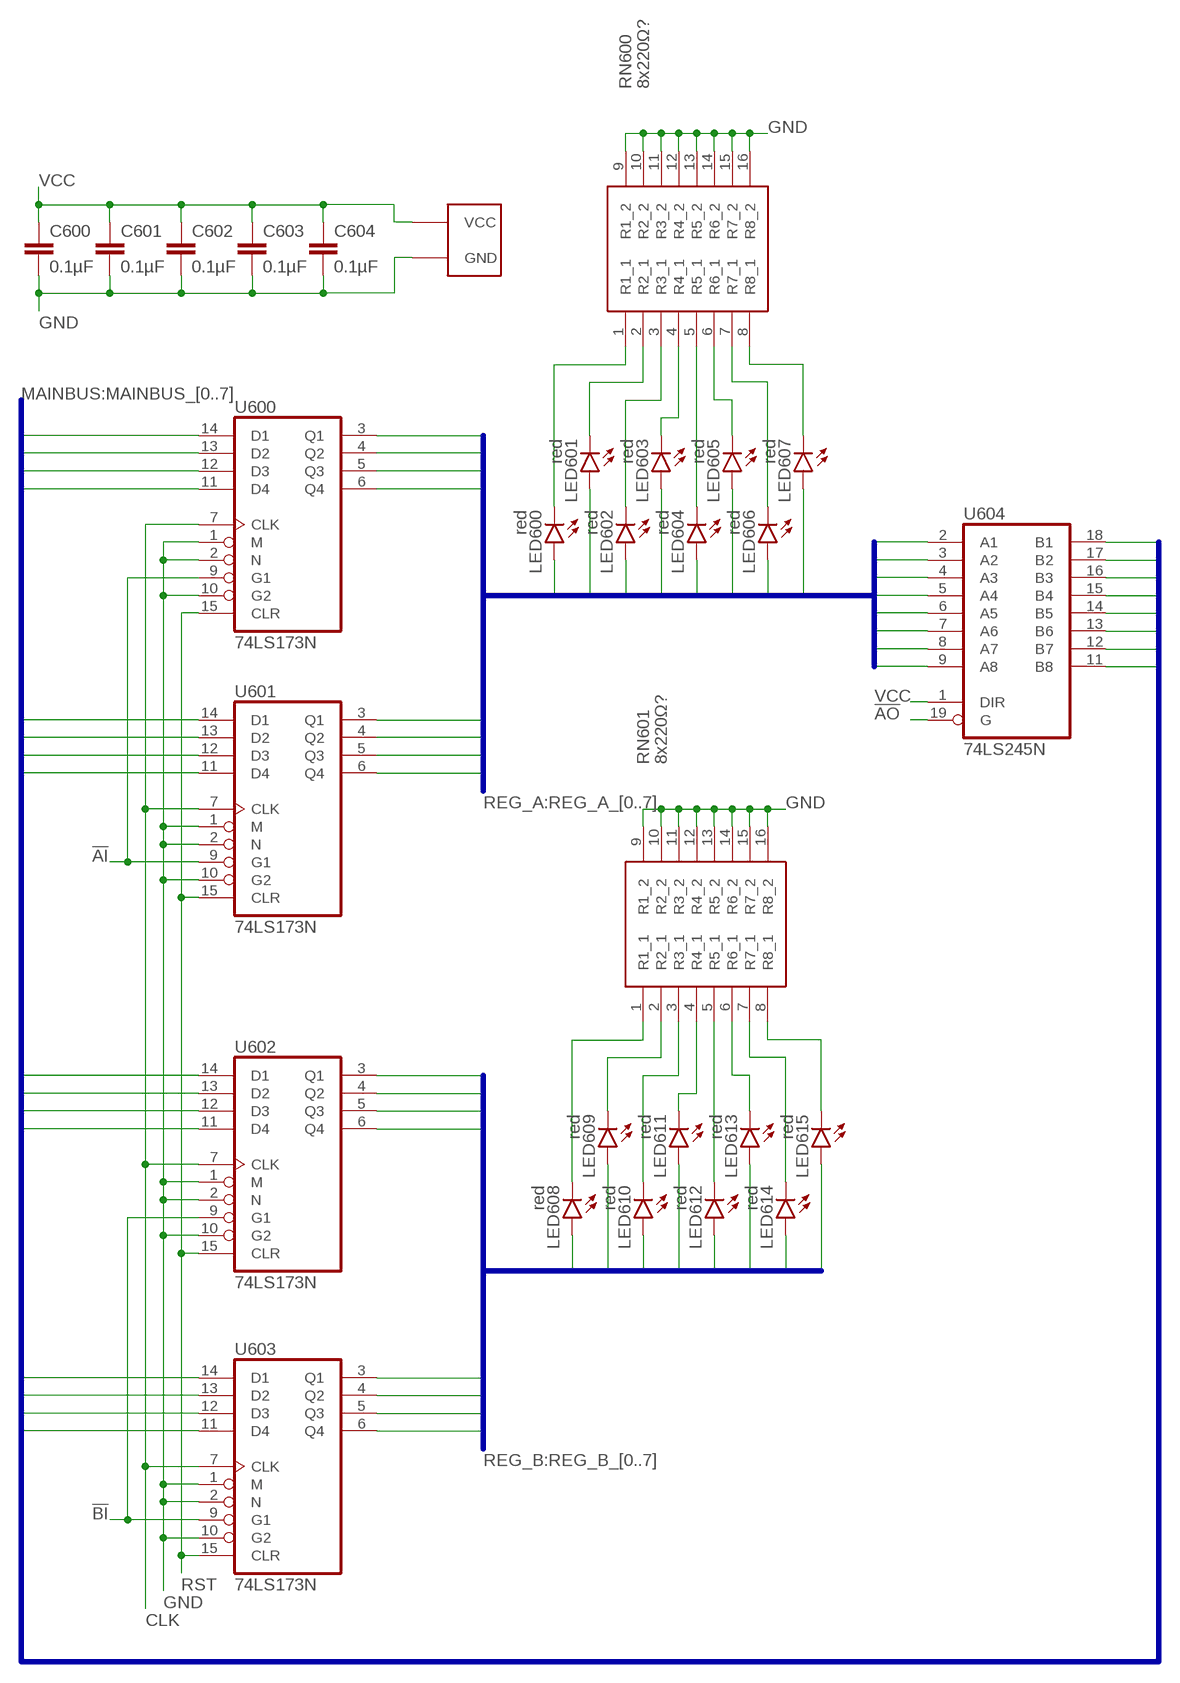
[diagram p6: schematic, sheet 6]

### Parts
C600  0.1µF  C-EUC0805K  [C0805K]
C601  0.1µF  C-EUC0805K  [C0805K]
C602  0.1µF  C-EUC0805K  [C0805K]
C603  0.1µF  C-EUC0805K  [C0805K]
C604  0.1µF  C-EUC0805K  [C0805K]
LED600  red  LED3MM  [LED3MM]
LED601  red  LED3MM  [LED3MM]
LED602  red  LED3MM  [LED3MM]
LED603  red  LED3MM  [LED3MM]
LED604  red  LED3MM  [LED3MM]
LED605  red  LED3MM  [LED3MM]
LED606  red  LED3MM  [LED3MM]
LED607  red  LED3MM  [LED3MM]
LED608  red  LED3MM  [LED3MM]
LED609  red  LED3MM  [LED3MM]
LED610  red  LED3MM  [LED3MM]
LED611  red  LED3MM  [LED3MM]
LED612  red  LED3MM  [LED3MM]
LED613  red  LED3MM  [LED3MM]
LED614  red  LED3MM  [LED3MM]
LED615  red  LED3MM  [LED3MM]
RN600  8x220Ω?  CAY16-102J8LF  [CAY16102J8LF]
RN601  8x220Ω?  CAY16-102J8LF  [CAY16102J8LF]
U600  74LS173N  [DIL16]
U601  74LS173N  [DIL16]
U602  74LS173N  [DIL16]
U603  74LS173N  [DIL16]
U604  74LS245N  [DIL20]

### Nets
!AI: U600.9(G1) U601.9(G1) ; also sheet 11
!AO: U604.19(G) ; also sheet 11
!BI: U602.9(G1) U603.9(G1) ; also sheet 11
CLK: U600.7(CLK) U601.7(CLK) U602.7(CLK) U603.7(CLK) ; also sheet 1,2,3,4,5,7,9,10,11
GND: C600.2 C601.2 C602.2 C603.2 C604.2 RN600.9(R1_2) RN600.10(R2_2) RN600.11(R3_2) RN600.12(R4_2) RN600.13(R5_2) RN600.14(R6_2) RN600.15(R7_2) RN600.16(R8_2) RN601.9(R1_2) RN601.10(R2_2) RN601.11(R3_2) RN601.12(R4_2) RN601.13(R5_2) RN601.14(R6_2) RN601.15(R7_2) RN601.16(R8_2) U600.1(M) U600.2(N) U600.10(G2) U601.1(M) U601.2(N) U601.10(G2) U602.1(M) U602.2(N) U602.10(G2) U603.1(M) U603.2(N) U603.10(G2) ; supply symbol labelled SUPPLY ; also sheet 1,2,3,4,5,7,8,9,10,11
LED600_GND: LED600.K(C) RN600.1(R1_1)
LED601_GND: LED601.K(C) RN600.2(R2_1)
LED602_GND: LED602.K(C) RN600.3(R3_1)
LED603_GND: LED603.K(C) RN600.4(R4_1)
LED604_GND: LED604.K(C) RN600.5(R5_1)
LED605_GND: LED605.K(C) RN600.6(R6_1)
LED606_GND: LED606.K(C) RN600.7(R7_1)
LED607_GND: LED607.K(C) RN600.8(R8_1)
LED608_GND: LED608.K(C) RN601.1(R1_1)
LED609_GND: LED609.K(C) RN601.2(R2_1)
LED610_GND: LED610.K(C) RN601.3(R3_1)
LED611_GND: LED611.K(C) RN601.4(R4_1)
LED612_GND: LED612.K(C) RN601.5(R5_1)
LED613_GND: LED613.K(C) RN601.6(R6_1)
LED614_GND: LED614.K(C) RN601.7(R7_1)
LED615_GND: LED615.K(C) RN601.8(R8_1)
MAINBUS_0: U601.11(D4) U603.11(D4) U604.11(B8) ; also sheet 2,3,4,5,7,8,9,10,11
MAINBUS_1: U601.12(D3) U603.12(D3) U604.12(B7) ; also sheet 2,3,4,5,7,8,9,10,11
MAINBUS_2: U601.13(D2) U603.13(D2) U604.13(B6) ; also sheet 2,3,4,5,7,8,9,10,11
MAINBUS_3: U601.14(D1) U603.14(D1) U604.14(B5) ; also sheet 2,3,4,5,7,8,9,10,11
MAINBUS_4: U600.11(D4) U602.11(D4) U604.15(B4) ; also sheet 2,3,4,5,7,8,9,10,11
MAINBUS_5: U600.12(D3) U602.12(D3) U604.16(B3) ; also sheet 2,3,4,5,7,8,9,10,11
MAINBUS_6: U600.13(D2) U602.13(D2) U604.17(B2) ; also sheet 2,3,4,5,7,8,9,10,11
MAINBUS_7: U600.14(D1) U602.14(D1) U604.18(B1) ; also sheet 2,3,4,5,7,8,9,10
REG_A_0: LED607.A U601.6(Q4) U604.9(A8) ; also sheet 7,8
REG_A_1: LED606.A U601.5(Q3) U604.8(A7) ; also sheet 7,8
REG_A_2: LED605.A U601.4(Q2) U604.7(A6) ; also sheet 7,8
REG_A_3: LED604.A U601.3(Q1) U604.6(A5) ; also sheet 7,8
REG_A_4: LED603.A U600.6(Q4) U604.5(A4) ; also sheet 7,8
REG_A_5: LED602.A U600.5(Q3) U604.4(A3) ; also sheet 7,8
REG_A_6: LED601.A U600.4(Q2) U604.3(A2) ; also sheet 7,8
REG_A_7: LED600.A U600.3(Q1) U604.2(A1) ; also sheet 7,8
REG_B_0: LED615.A U603.6(Q4) ; also sheet 7,8
REG_B_1: LED614.A U603.5(Q3) ; also sheet 7,8
REG_B_2: LED613.A U603.4(Q2) ; also sheet 7,8
REG_B_3: LED612.A U603.3(Q1) ; also sheet 7,8
REG_B_4: LED611.A U602.6(Q4) ; also sheet 7,8
REG_B_5: LED610.A U602.5(Q3) ; also sheet 7,8
REG_B_6: LED609.A U602.4(Q2) ; also sheet 7,8
REG_B_7: LED608.A U602.3(Q1) ; also sheet 7,8
RST: U600.15(CLR) U601.15(CLR) U602.15(CLR) U603.15(CLR) ; also sheet 2,3,5,7,9,10,11
VCC: C600.1 C601.1 C602.1 C603.1 C604.1 U604.1(DIR) ; supply symbol labelled SUPPLY ; also sheet 1,2,3,4,5,7,8,9,10,11

### Buses
REG_A:REG_A_[0..7]
REG_B:REG_B_[0..7]
MAINBUS:MAINBUS_[0..7]

## Sheet 7 of 11: ALU & Comparator
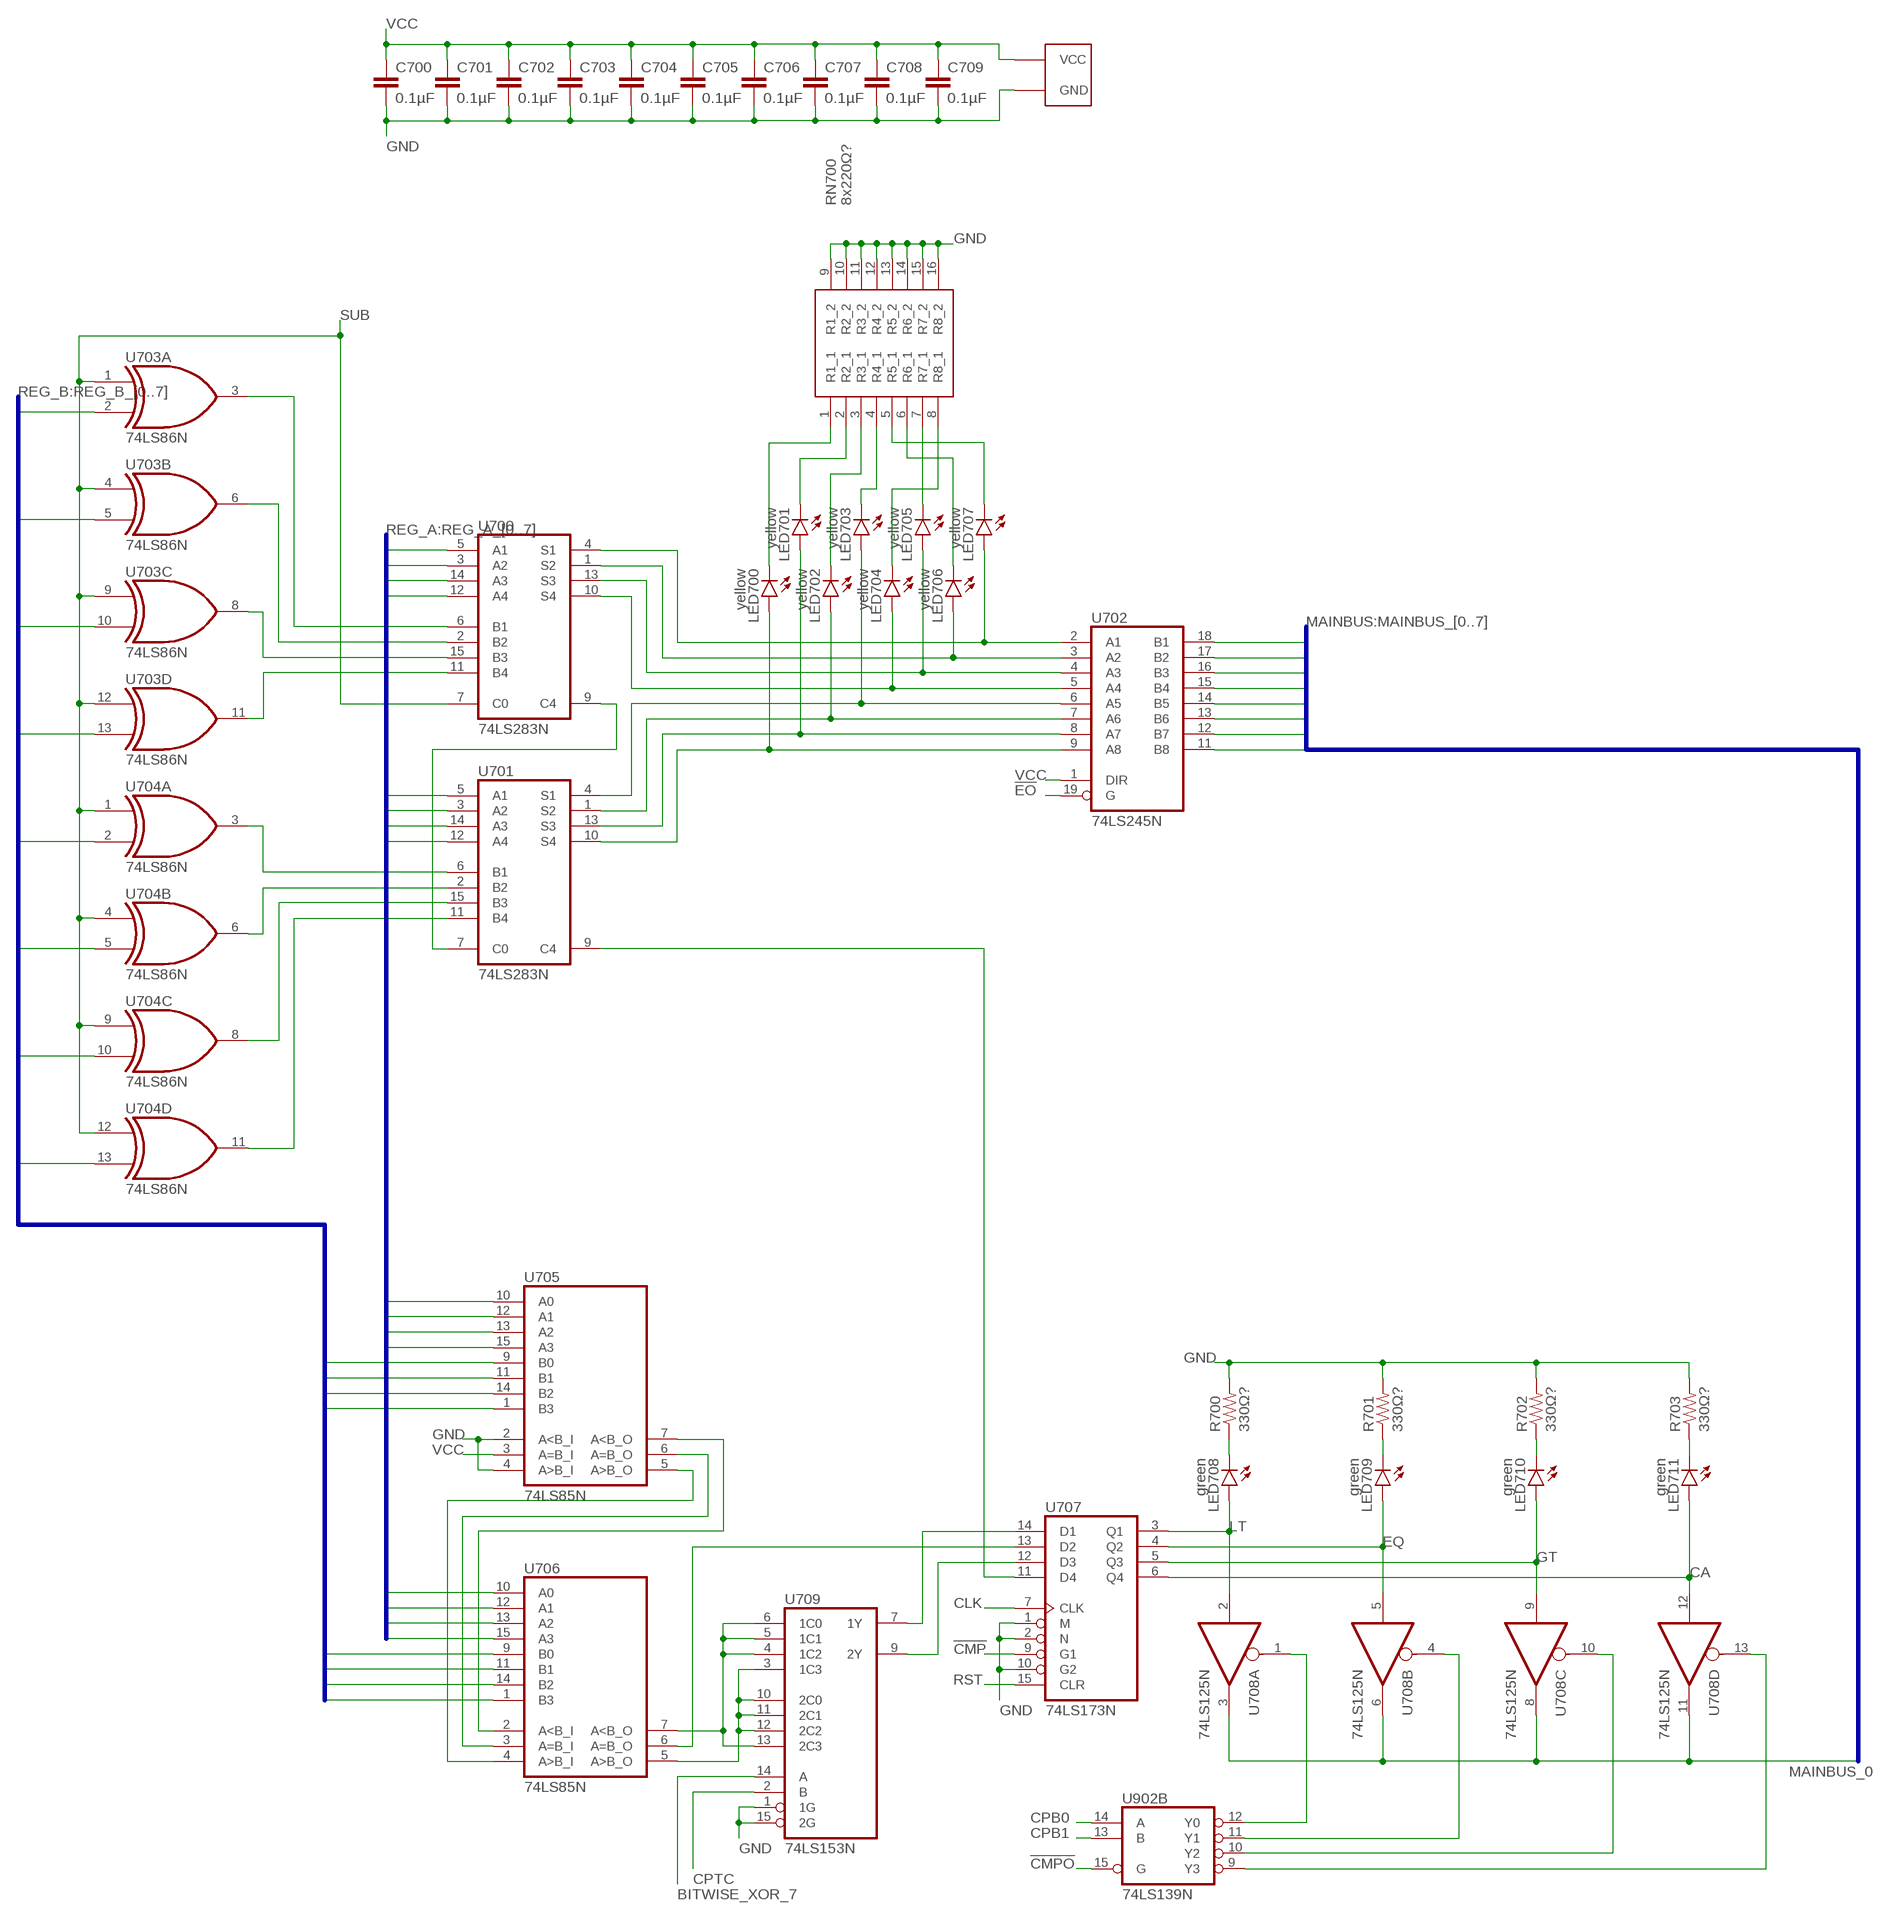
[diagram p7: schematic, sheet 7]

### Parts
C700  0.1µF  C-EUC0805K  [C0805K]
C701  0.1µF  C-EUC0805K  [C0805K]
C702  0.1µF  C-EUC0805K  [C0805K]
C703  0.1µF  C-EUC0805K  [C0805K]
C704  0.1µF  C-EUC0805K  [C0805K]
C705  0.1µF  C-EUC0805K  [C0805K]
C706  0.1µF  C-EUC0805K  [C0805K]
C707  0.1µF  C-EUC0805K  [C0805K]
C708  0.1µF  C-EUC0805K  [C0805K]
C709  0.1µF  C-EUC0805K  [C0805K]
LED700  yellow  LED3MM  [LED3MM]
LED701  yellow  LED3MM  [LED3MM]
LED702  yellow  LED3MM  [LED3MM]
LED703  yellow  LED3MM  [LED3MM]
LED704  yellow  LED3MM  [LED3MM]
LED705  yellow  LED3MM  [LED3MM]
LED706  yellow  LED3MM  [LED3MM]
LED707  yellow  LED3MM  [LED3MM]
LED708  green  LED3MM  [LED3MM]
LED709  green  LED3MM  [LED3MM]
LED710  green  LED3MM  [LED3MM]
LED711  green  LED3MM  [LED3MM]
R700  330Ω?  R-US_R0805  [R0805]
R701  330Ω?  R-US_R0805  [R0805]
R702  330Ω?  R-US_R0805  [R0805]
R703  330Ω?  R-US_R0805  [R0805]
RN700  8x220Ω?  CAY16-102J8LF  [CAY16102J8LF]
U700  74LS283N  [DIL16]
U701  74LS283N  [DIL16]
U702  74LS245N  [DIL20]
U703  74LS86N  [DIL14]
U704  74LS86N  [DIL14]
U705  74LS85N  [DIL16]
U706  74LS85N  [DIL16]
U707  74LS173N  [DIL16]
U708  74LS125N  [DIL14]
U709  74LS153N  [DIL16]
U902  74LS139N  [DIL16]

### Nets
!CMP: U707.9(G1) ; also sheet 11
!CMP_CA_OUT: U708.13(D:OE) U902.9(B:Y3)
!CMP_EQ_OUT: U708.4(B:OE) U902.11(B:Y1)
!CMP_GT_OUT: U708.10(C:OE) U902.10(B:Y2)
!CMP_LT_OUT: U708.1(A:OE) U902.12(B:Y0)
!CMPO: U902.15(B:G) ; also sheet 11
!EO: U702.19(G) ; also sheet 11
ALU_B_0: U700.6(B1) U703.3(A:O)
ALU_B_1: U700.2(B2) U703.6(B:O)
ALU_B_2: U700.15(B3) U703.8(C:O)
ALU_B_3: U700.11(B4) U703.11(D:O)
ALU_B_4: U701.6(B1) U704.3(A:O)
ALU_B_5: U701.2(B2) U704.6(B:O)
ALU_B_6: U701.15(B3) U704.8(C:O)
ALU_B_7: U701.11(B4) U704.11(D:O)
ALU_CARRY_OVER: U701.9(C4) U707.11(D4)
ALU_INT_CARRY: U700.9(C4) U701.7(C0)
ALU_SUM_0: LED707.A U700.4(S1) U702.2(A1)
ALU_SUM_1: LED706.A U700.1(S2) U702.3(A2)
ALU_SUM_2: LED705.A U700.13(S3) U702.4(A3)
ALU_SUM_3: LED704.A U700.10(S4) U702.5(A4)
ALU_SUM_4: LED703.A U701.4(S1) U702.6(A5)
ALU_SUM_5: LED702.A U701.1(S2) U702.7(A6)
ALU_SUM_6: LED701.A U701.13(S3) U702.8(A7)
ALU_SUM_7: LED700.A U701.10(S4) U702.9(A8)
BITWISE_XOR_7: U709.14(A) ; also sheet 8
CA: LED711.A U707.6(Q4) U708.12(D:I)
CLK: U707.7(CLK) ; also sheet 1,2,3,4,5,6,9,10,11
CMP_<_CARRY: U705.7(A<B_O) U706.2(A<B_I)
CMP_=_CARRY: U705.6(A=B_O) U706.3(A=B_I)
CMP_>_CARRY: U705.5(A>B_O) U706.4(A>B_I)
CMP_EQ_INT: U706.6(A=B_O) U707.13(D2)
CMP_GT_INT: U707.12(D3) U709.9(2Y)
CMP_GT_PRE: U706.5(A>B_O) U709.3(1C3) U709.10(2C0) U709.11(2C1) U709.12(2C2)
CMP_LT_INT: U707.14(D1) U709.7(1Y)
CMP_LT_PRE: U706.7(A<B_O) U709.4(1C2) U709.5(1C1) U709.6(1C0) U709.13(2C3)
CPB0: U902.14(B:A) ; also sheet 11
CPB1: U902.13(B:B) ; also sheet 11
CPTC: U709.2(B) ; also sheet 11
EQ: LED709.A U707.4(Q2) U708.5(B:I)
GND: C700.2 C701.2 C702.2 C703.2 C704.2 C705.2 C706.2 C707.2 C708.2 C709.2 R700.2 R701.2 R702.2 R703.2 RN700.9(R1_2) RN700.10(R2_2) RN700.11(R3_2) RN700.12(R4_2) RN700.13(R5_2) RN700.14(R6_2) RN700.15(R7_2) RN700.16(R8_2) U705.2(A<B_I) U705.4(A>B_I) U707.1(M) U707.2(N) U707.10(G2) U709.1(1G) U709.15(2G) ; supply symbol labelled SUPPLY ; also sheet 1,2,3,4,5,6,8,9,10,11
GT: LED710.A U707.5(Q3) U708.9(C:I) ; also sheet 11
LED700_GND: LED700.K(C) RN700.1(R1_1)
LED701_GND: LED701.K(C) RN700.2(R2_1)
LED702_GND: LED702.K(C) RN700.3(R3_1)
LED703_GND: LED703.K(C) RN700.4(R4_1)
LED704_GND: LED704.K(C) RN700.8(R8_1)
LED705_GND: LED705.K(C) RN700.7(R7_1)
LED706_GND: LED706.K(C) RN700.6(R6_1)
LED707_GND: LED707.K(C) RN700.5(R5_1)
LED708_GND: LED708.K(C) R700.1
LED709_GND: LED709.K(C) R701.1
LED710_GND: LED710.K(C) R702.1
LED711_GND: LED711.K(C) R703.1
LT: LED708.A U707.3(Q1) U708.2(A:I) ; also sheet 11
MAINBUS_0: U702.18(B1) U708.3(A:O) U708.6(B:O) U708.8(C:O) U708.11(D:O) ; also sheet 2,3,4,5,6,8,9,10,11
MAINBUS_1: U702.17(B2) ; also sheet 2,3,4,5,6,8,9,10,11
MAINBUS_2: U702.16(B3) ; also sheet 2,3,4,5,6,8,9,10,11
MAINBUS_3: U702.15(B4) ; also sheet 2,3,4,5,6,8,9,10,11
MAINBUS_4: U702.14(B5) ; also sheet 2,3,4,5,6,8,9,10,11
MAINBUS_5: U702.13(B6) ; also sheet 2,3,4,5,6,8,9,10,11
MAINBUS_6: U702.12(B7) ; also sheet 2,3,4,5,6,8,9,10,11
MAINBUS_7: U702.11(B8) ; also sheet 2,3,4,5,6,8,9,10
REG_A_0: U700.5(A1) U705.10(A0) ; also sheet 6,8
REG_A_1: U700.3(A2) U705.12(A1) ; also sheet 6,8
REG_A_2: U700.14(A3) U705.13(A2) ; also sheet 6,8
REG_A_3: U700.12(A4) U705.15(A3) ; also sheet 6,8
REG_A_4: U701.5(A1) U706.10(A0) ; also sheet 6,8
REG_A_5: U701.3(A2) U706.12(A1) ; also sheet 6,8
REG_A_6: U701.14(A3) U706.13(A2) ; also sheet 6,8
REG_A_7: U701.12(A4) U706.15(A3) ; also sheet 6,8
REG_B_0: U703.2(A:I1) U705.9(B0) ; also sheet 6,8
REG_B_1: U703.5(B:I1) U705.11(B1) ; also sheet 6,8
REG_B_2: U703.10(C:I1) U705.14(B2) ; also sheet 6,8
REG_B_3: U703.13(D:I1) U705.1(B3) ; also sheet 6,8
REG_B_4: U704.2(A:I1) U706.9(B0) ; also sheet 6,8
REG_B_5: U704.5(B:I1) U706.11(B1) ; also sheet 6,8
REG_B_6: U704.10(C:I1) U706.14(B2) ; also sheet 6,8
REG_B_7: U704.13(D:I1) U706.1(B3) ; also sheet 6,8
RST: U707.15(CLR) ; also sheet 2,3,5,6,9,10,11
SUB: U700.7(C0) U703.1(A:I0) U703.4(B:I0) U703.9(C:I0) U703.12(D:I0) U704.1(A:I0) U704.4(B:I0) U704.9(C:I0) U704.12(D:I0) ; also sheet 11
VCC: C700.1 C701.1 C702.1 C703.1 C704.1 C705.1 C706.1 C707.1 C708.1 C709.1 U702.1(DIR) U705.3(A=B_I) ; supply symbol labelled SUPPLY ; also sheet 1,2,3,4,5,6,8,9,10,11

### Buses
REG_A:REG_A_[0..7]
REG_B:REG_B_[0..7]
MAINBUS:MAINBUS_[0..7]

## Sheet 8 of 11: Bitwise Operations
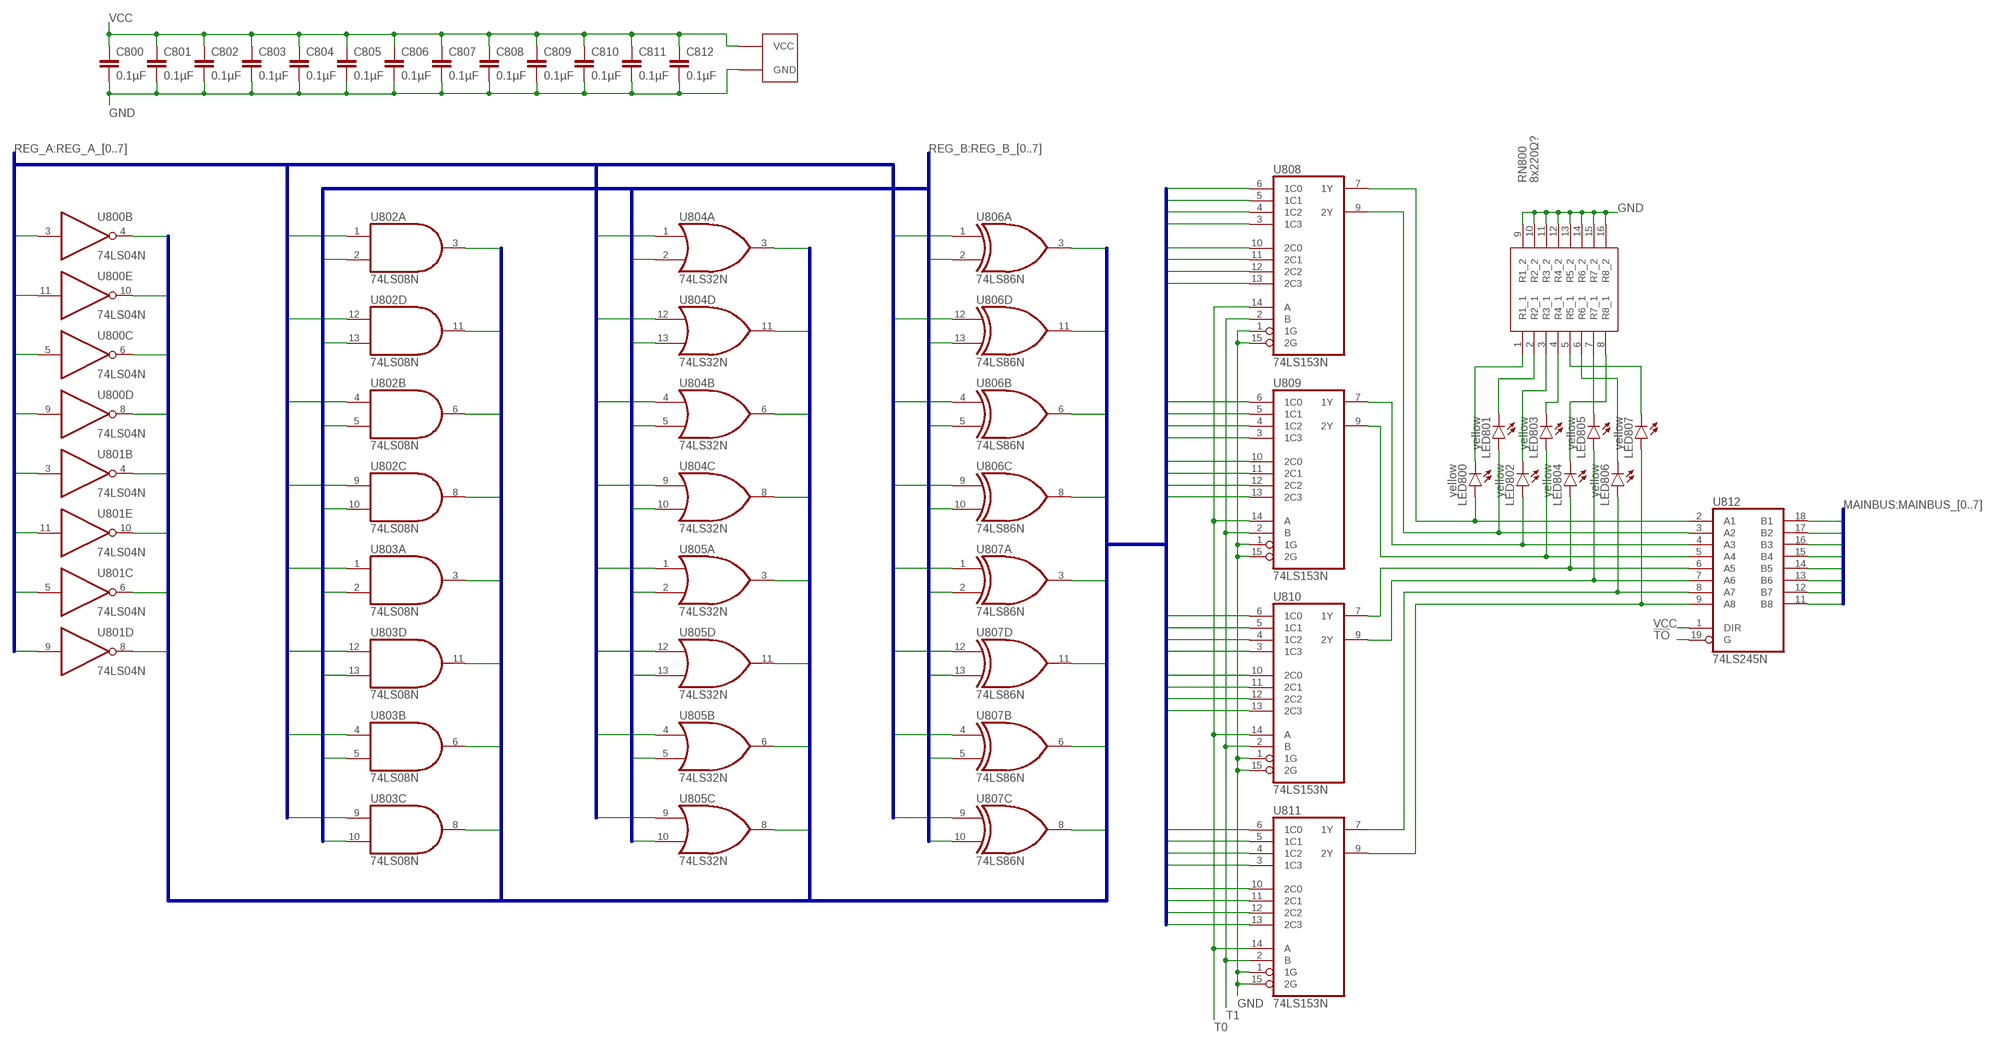
[diagram p8: schematic, sheet 8]

### Parts
C800  0.1µF  C-EUC0805K  [C0805K]
C801  0.1µF  C-EUC0805K  [C0805K]
C802  0.1µF  C-EUC0805K  [C0805K]
C803  0.1µF  C-EUC0805K  [C0805K]
C804  0.1µF  C-EUC0805K  [C0805K]
C805  0.1µF  C-EUC0805K  [C0805K]
C806  0.1µF  C-EUC0805K  [C0805K]
C807  0.1µF  C-EUC0805K  [C0805K]
C808  0.1µF  C-EUC0805K  [C0805K]
C809  0.1µF  C-EUC0805K  [C0805K]
C810  0.1µF  C-EUC0805K  [C0805K]
C811  0.1µF  C-EUC0805K  [C0805K]
C812  0.1µF  C-EUC0805K  [C0805K]
LED800  yellow  LED3MM  [LED3MM]
LED801  yellow  LED3MM  [LED3MM]
LED802  yellow  LED3MM  [LED3MM]
LED803  yellow  LED3MM  [LED3MM]
LED804  yellow  LED3MM  [LED3MM]
LED805  yellow  LED3MM  [LED3MM]
LED806  yellow  LED3MM  [LED3MM]
LED807  yellow  LED3MM  [LED3MM]
RN800  8x220Ω?  CAY16-102J8LF  [CAY16102J8LF]
U800  74LS04N  [DIL14]
U801  74LS04N  [DIL14]
U802  74LS08N  [DIL14]
U803  74LS08N  [DIL14]
U804  74LS32N  [DIL14]
U805  74LS32N  [DIL14]
U806  74LS86N  [DIL14]
U807  74LS86N  [DIL14]
U808  74LS153N  [DIL16]
U809  74LS153N  [DIL16]
U810  74LS153N  [DIL16]
U811  74LS153N  [DIL16]
U812  74LS245N  [DIL20]

### Nets
!TO: U812.19(G) ; also sheet 11
BITWISE_AND_0: U803.8(C:O) U811.11(2C1)
BITWISE_AND_1: U803.6(B:O) U811.5(1C1)
BITWISE_AND_2: U803.11(D:O) U810.11(2C1)
BITWISE_AND_3: U803.3(A:O) U810.5(1C1)
BITWISE_AND_4: U802.8(C:O) U809.11(2C1)
BITWISE_AND_5: U802.6(B:O) U809.5(1C1)
BITWISE_AND_6: U802.11(D:O) U808.11(2C1)
BITWISE_AND_7: U802.3(A:O) U808.5(1C1)
BITWISE_NOT_0: U801.8(D:O) U811.10(2C0)
BITWISE_NOT_1: U801.6(C:O) U811.6(1C0)
BITWISE_NOT_2: U801.10(E:O) U810.10(2C0)
BITWISE_NOT_3: U801.4(B:O) U810.6(1C0)
BITWISE_NOT_4: U800.8(D:O) U809.10(2C0)
BITWISE_NOT_5: U800.6(C:O) U809.6(1C0)
BITWISE_NOT_6: U800.10(E:O) U808.10(2C0)
BITWISE_NOT_7: U800.4(B:O) U808.6(1C0)
BITWISE_OR_0: U805.8(C:O) U811.12(2C2)
BITWISE_OR_1: U805.6(B:O) U811.4(1C2)
BITWISE_OR_2: U805.11(D:O) U810.12(2C2)
BITWISE_OR_3: U805.3(A:O) U810.4(1C2)
BITWISE_OR_4: U804.8(C:O) U809.12(2C2)
BITWISE_OR_5: U804.6(B:O) U809.4(1C2)
BITWISE_OR_6: U804.11(D:O) U808.12(2C2)
BITWISE_OR_7: U804.3(A:O) U808.4(1C2)
BITWISE_OUT_0: LED807.A U811.9(2Y) U812.9(A8)
BITWISE_OUT_1: LED806.A U811.7(1Y) U812.8(A7)
BITWISE_OUT_2: LED805.A U810.9(2Y) U812.7(A6)
BITWISE_OUT_3: LED804.A U810.7(1Y) U812.6(A5)
BITWISE_OUT_4: LED803.A U809.9(2Y) U812.5(A4)
BITWISE_OUT_5: LED802.A U809.7(1Y) U812.4(A3)
BITWISE_OUT_6: LED801.A U808.9(2Y) U812.3(A2)
BITWISE_OUT_7: LED800.A U808.7(1Y) U812.2(A1)
BITWISE_XOR_0: U807.8(C:O) U811.13(2C3)
BITWISE_XOR_1: U807.6(B:O) U811.3(1C3)
BITWISE_XOR_2: U807.11(D:O) U810.13(2C3)
BITWISE_XOR_3: U807.3(A:O) U810.3(1C3)
BITWISE_XOR_4: U806.8(C:O) U809.13(2C3)
BITWISE_XOR_5: U806.6(B:O) U809.3(1C3)
BITWISE_XOR_6: U806.11(D:O) U808.13(2C3)
BITWISE_XOR_7: U806.3(A:O) U808.3(1C3) ; also sheet 7
GND: C800.2 C801.2 C802.2 C803.2 C804.2 C805.2 C806.2 C807.2 C808.2 C809.2 C810.2 C811.2 C812.2 RN800.9(R1_2) RN800.10(R2_2) RN800.11(R3_2) RN800.12(R4_2) RN800.13(R5_2) RN800.14(R6_2) RN800.15(R7_2) RN800.16(R8_2) U808.1(1G) U808.15(2G) U809.1(1G) U809.15(2G) U810.1(1G) U810.15(2G) U811.1(1G) U811.15(2G) ; supply symbol labelled SUPPLY ; also sheet 1,2,3,4,5,6,7,9,10,11
LED800_GND: LED800.K(C) RN800.1(R1_1)
LED801_GND: LED801.K(C) RN800.2(R2_1)
LED802_GND: LED802.K(C) RN800.3(R3_1)
LED803_GND: LED803.K(C) RN800.4(R4_1)
LED804_GND: LED804.K(C) RN800.8(R8_1)
LED805_GND: LED805.K(C) RN800.7(R7_1)
LED806_GND: LED806.K(C) RN800.6(R6_1)
LED807_GND: LED807.K(C) RN800.5(R5_1)
MAINBUS_0: U812.11(B8) ; also sheet 2,3,4,5,6,7,9,10,11
MAINBUS_1: U812.12(B7) ; also sheet 2,3,4,5,6,7,9,10,11
MAINBUS_2: U812.13(B6) ; also sheet 2,3,4,5,6,7,9,10,11
MAINBUS_3: U812.14(B5) ; also sheet 2,3,4,5,6,7,9,10,11
MAINBUS_4: U812.15(B4) ; also sheet 2,3,4,5,6,7,9,10,11
MAINBUS_5: U812.16(B3) ; also sheet 2,3,4,5,6,7,9,10,11
MAINBUS_6: U812.17(B2) ; also sheet 2,3,4,5,6,7,9,10,11
MAINBUS_7: U812.18(B1) ; also sheet 2,3,4,5,6,7,9,10
REG_A_0: U801.9(D:I) U803.9(C:I0) U805.9(C:I0) U807.9(C:I0) ; also sheet 6,7
REG_A_1: U801.5(C:I) U803.4(B:I0) U805.4(B:I0) U807.4(B:I0) ; also sheet 6,7
REG_A_2: U801.11(E:I) U803.12(D:I0) U805.12(D:I0) U807.12(D:I0) ; also sheet 6,7
REG_A_3: U801.3(B:I) U803.1(A:I0) U805.1(A:I0) U807.1(A:I0) ; also sheet 6,7
REG_A_4: U800.9(D:I) U802.9(C:I0) U804.9(C:I0) U806.9(C:I0) ; also sheet 6,7
REG_A_5: U800.5(C:I) U802.4(B:I0) U804.4(B:I0) U806.4(B:I0) ; also sheet 6,7
REG_A_6: U800.11(E:I) U802.12(D:I0) U804.12(D:I0) U806.12(D:I0) ; also sheet 6,7
REG_A_7: U800.3(B:I) U802.1(A:I0) U804.1(A:I0) U806.1(A:I0) ; also sheet 6,7
REG_B_0: U803.10(C:I1) U805.10(C:I1) U807.10(C:I1) ; also sheet 6,7
REG_B_1: U803.5(B:I1) U805.5(B:I1) U807.5(B:I1) ; also sheet 6,7
REG_B_2: U803.13(D:I1) U805.13(D:I1) U807.13(D:I1) ; also sheet 6,7
REG_B_3: U803.2(A:I1) U805.2(A:I1) U807.2(A:I1) ; also sheet 6,7
REG_B_4: U802.10(C:I1) U804.10(C:I1) U806.10(C:I1) ; also sheet 6,7
REG_B_5: U802.5(B:I1) U804.5(B:I1) U806.5(B:I1) ; also sheet 6,7
REG_B_6: U802.13(D:I1) U804.13(D:I1) U806.13(D:I1) ; also sheet 6,7
REG_B_7: U802.2(A:I1) U804.2(A:I1) U806.2(A:I1) ; also sheet 6,7
T0: U808.14(A) U809.14(A) U810.14(A) U811.14(A) ; also sheet 11
T1: U808.2(B) U809.2(B) U810.2(B) U811.2(B) ; also sheet 11
VCC: C800.1 C801.1 C802.1 C803.1 C804.1 C805.1 C806.1 C807.1 C808.1 C809.1 C810.1 C811.1 C812.1 U812.1(DIR) ; supply symbol labelled SUPPLY ; also sheet 1,2,3,4,5,6,7,9,10,11
Unconnected: U801.1(A:I) U801.2(A:O) U801.12(F:O) U801.13(F:I)

### Buses
BITWISE_INT:BITWISE_AND_[0..7],BITWISE_NOT_[0..7],BITWISE_OR_[0..7],BITWISE_XOR_[0..7]
REG_A:REG_A_[0..7]
REG_B:REG_B_[0..7]
MAINBUS:MAINBUS_[0..7]

## Sheet 9 of 11: Numerical Output
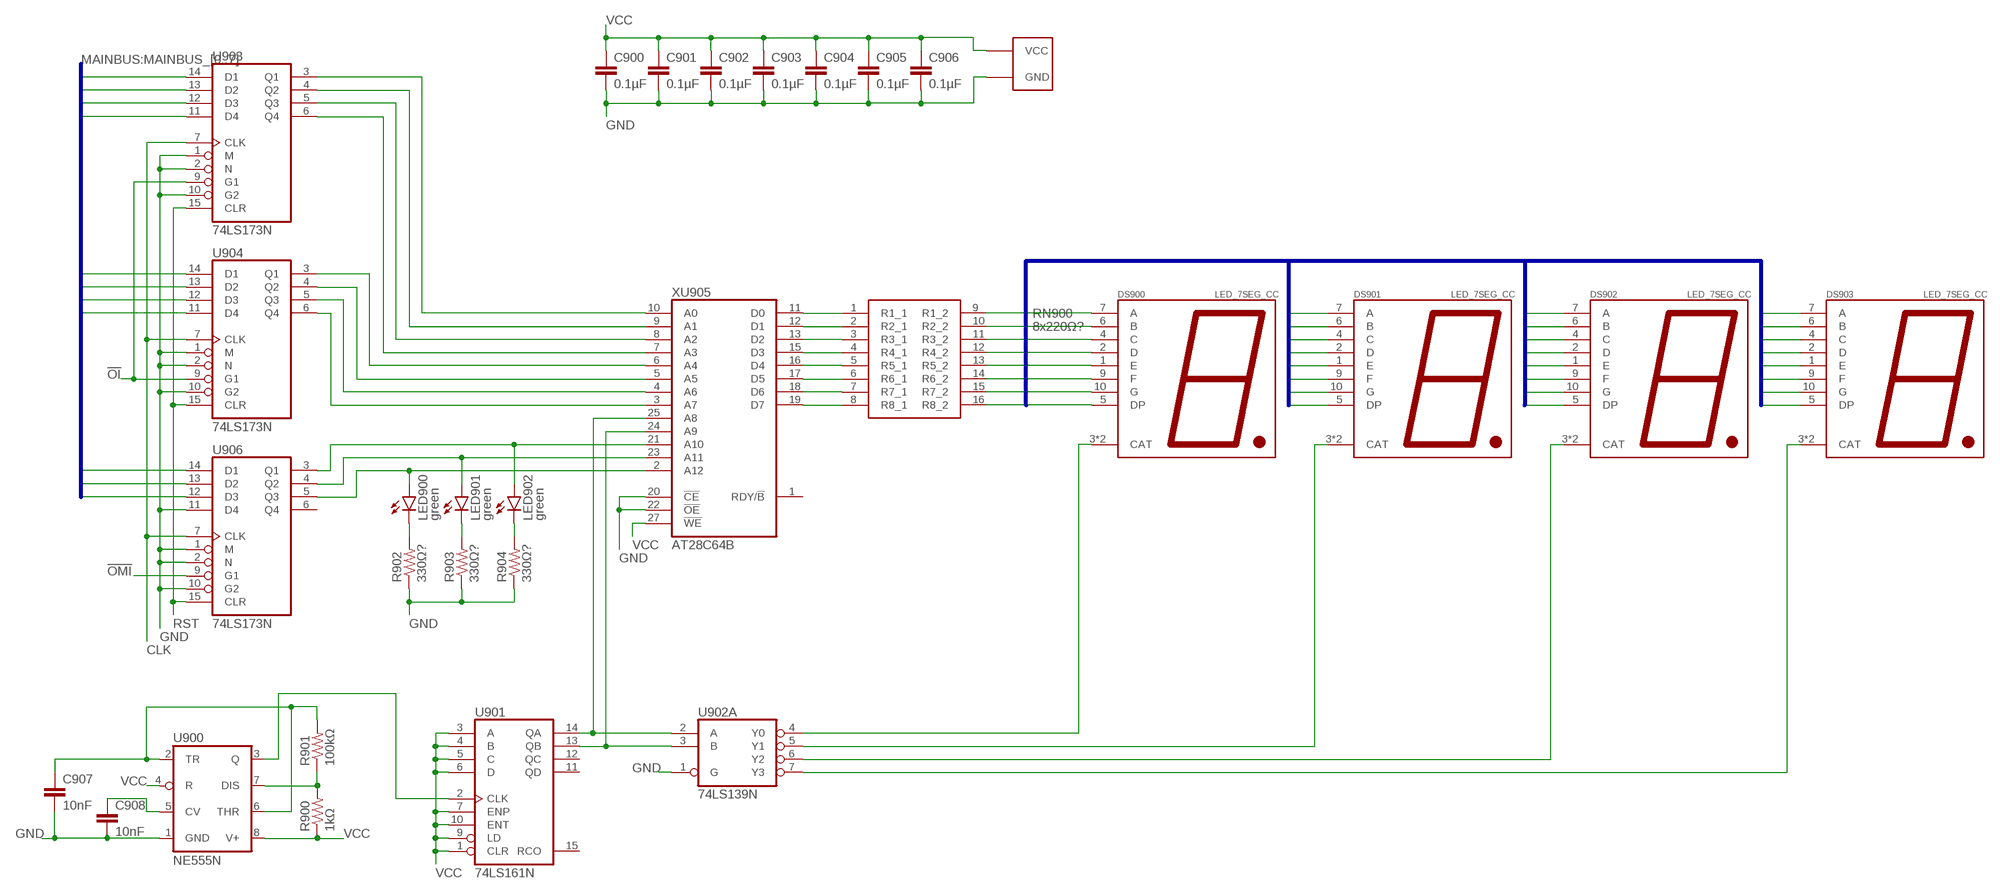
[diagram p9: schematic, sheet 9]

### Parts
C900  0.1µF  C-EUC0805K  [C0805K]
C901  0.1µF  C-EUC0805K  [C0805K]
C902  0.1µF  C-EUC0805K  [C0805K]
C903  0.1µF  C-EUC0805K  [C0805K]
C904  0.1µF  C-EUC0805K  [C0805K]
C905  0.1µF  C-EUC0805K  [C0805K]
C906  0.1µF  C-EUC0805K  [C0805K]
C907  10nF  C-EUC0805K  [C0805K]
C908  10nF  C-EUC0805K  [C0805K]
DS900  LED_7SEG_CC  [LED_7SEG]
DS901  LED_7SEG_CC  [LED_7SEG]
DS902  LED_7SEG_CC  [LED_7SEG]
DS903  LED_7SEG_CC  [LED_7SEG]
LED900  green  LED3MM  [LED3MM]
LED901  green  LED3MM  [LED3MM]
LED902  green  LED3MM  [LED3MM]
R900  1kΩ  R-US_R0805  [R0805]
R901  100kΩ  R-US_R0805  [R0805]
R902  330Ω?  R-US_R0805  [R0805]
R903  330Ω?  R-US_R0805  [R0805]
R904  330Ω?  R-US_R0805  [R0805]
RN900  8x220Ω?  CAY16-102J8LF  [CAY16102J8LF]
U900  NE555N  [DIL08]
U901  74LS161N  [DIL16]
U903  74LS173N  [DIL16]
U904  74LS173N  [DIL16]
U906  74LS173N  [DIL16]
XU905  AT28C64B  2864  [DIL28]

### Nets
!OI: U903.9(G1) U904.9(G1) ; also sheet 11
!OMI: U906.9(G1) ; also sheet 11
CLK: U903.7(CLK) U904.7(CLK) U906.7(CLK) ; also sheet 1,2,3,4,5,6,7,10,11
GND: C900.2 C901.2 C902.2 C903.2 C904.2 C905.2 C906.2 C907.2 C908.2 R902.1 R903.1 R904.1 U900.1(GND) U902.1(A:G) U903.1(M) U903.2(N) U903.10(G2) U904.1(M) U904.2(N) U904.10(G2) U906.1(M) U906.2(N) U906.10(G2) U906.11(D4) XU905.20(!CE) XU905.22(!OE) ; supply symbol labelled SUPPLY ; also sheet 1,2,3,4,5,6,7,8,10,11
LED900_GND: LED900.K(C) R902.2
LED901_GND: LED901.K(C) R903.2
LED902_GND: LED902.K(C) R904.2
MAINBUS_0: U903.14(D1) U906.14(D1) ; also sheet 2,3,4,5,6,7,8,10,11
MAINBUS_1: U903.13(D2) U906.13(D2) ; also sheet 2,3,4,5,6,7,8,10,11
MAINBUS_2: U903.12(D3) U906.12(D3) ; also sheet 2,3,4,5,6,7,8,10,11
MAINBUS_3: U903.11(D4) ; also sheet 2,3,4,5,6,7,8,10,11
MAINBUS_4: U904.14(D1) ; also sheet 2,3,4,5,6,7,8,10,11
MAINBUS_5: U904.13(D2) ; also sheet 2,3,4,5,6,7,8,10,11
MAINBUS_6: U904.12(D3) ; also sheet 2,3,4,5,6,7,8,10,11
MAINBUS_7: U904.11(D4) ; also sheet 2,3,4,5,6,7,8,10
OUT_CAT_0: DS900.3(CAT) DS900.8(CAT) U902.4(A:Y0)
OUT_CAT_1: DS901.3(CAT) DS901.8(CAT) U902.5(A:Y1)
OUT_CAT_2: DS902.3(CAT) DS902.8(CAT) U902.6(A:Y2)
OUT_CAT_3: DS903.3(CAT) DS903.8(CAT) U902.7(A:Y3)
OUT_DATA_0: U903.3(Q1) XU905.10(A0)
OUT_DATA_1: U903.4(Q2) XU905.9(A1)
OUT_DATA_2: U903.5(Q3) XU905.8(A2)
OUT_DATA_3: U903.6(Q4) XU905.7(A3)
OUT_DATA_4: U904.3(Q1) XU905.6(A4)
OUT_DATA_5: U904.4(Q2) XU905.5(A5)
OUT_DATA_6: U904.5(Q3) XU905.4(A6)
OUT_DATA_7: U904.6(Q4) XU905.3(A7)
OUT_MODE_0: LED902.A U906.3(Q1) XU905.21(A10)
OUT_MODE_1: LED901.A U906.4(Q2) XU905.23(A11)
OUT_MODE_2: LED900.A U906.5(Q3) XU905.2(A12)
OUT_MUX_0: U901.14(QA) U902.2(A:A) XU905.25(A8)
OUT_MUX_1: U901.13(QB) U902.3(A:B) XU905.24(A9)
OUT_MUX_CLK: U900.3(Q) U901.2(CLK)
OUT_SEG_A: DS900.7(A) DS901.7(A) DS902.7(A) DS903.7(A) RN900.9(R1_2)
OUT_SEG_A_INT: RN900.1(R1_1) XU905.11(D0)
OUT_SEG_B: DS900.6(B) DS901.6(B) DS902.6(B) DS903.6(B) RN900.10(R2_2)
OUT_SEG_B_INT: RN900.2(R2_1) XU905.12(D1)
OUT_SEG_C: DS900.4(C) DS901.4(C) DS902.4(C) DS903.4(C) RN900.11(R3_2)
OUT_SEG_C_INT: RN900.3(R3_1) XU905.13(D2)
OUT_SEG_D: DS900.2(D) DS901.2(D) DS902.2(D) DS903.2(D) RN900.12(R4_2)
OUT_SEG_D_INT: RN900.4(R4_1) XU905.15(D3)
OUT_SEG_DP: DS900.5(DP) DS901.5(DP) DS902.5(DP) DS903.5(DP) RN900.16(R8_2)
OUT_SEG_DP_INT: RN900.8(R8_1) XU905.19(D7)
OUT_SEG_E: DS900.1(E) DS901.1(E) DS902.1(E) DS903.1(E) RN900.13(R5_2)
OUT_SEG_E_INT: RN900.5(R5_1) XU905.16(D4)
OUT_SEG_F: DS900.9(F) DS901.9(F) DS902.9(F) DS903.9(F) RN900.14(R6_2)
OUT_SEG_F_INT: RN900.6(R6_1) XU905.17(D5)
OUT_SEG_G: DS900.10(G) DS901.10(G) DS902.10(G) DS903.10(G) RN900.15(R7_2)
OUT_SEG_G_INT: RN900.7(R7_1) XU905.18(D6)
RST: U903.15(CLR) U904.15(CLR) U906.15(CLR) ; also sheet 2,3,5,6,7,10,11
U900_CAP: C907.1 R901.2 U900.2(TR) U900.6(THR)
U900_CV: C908.1 U900.5(CV)
U900_DIS: R900.2 R901.1 U900.7(DIS)
VCC: C900.1 C901.1 C902.1 C903.1 C904.1 C905.1 C906.1 R900.1 U900.4(R) U900.8(V+) U901.1(CLR) U901.3(A) U901.4(B) U901.5(C) U901.6(D) U901.7(ENP) U901.9(LD) U901.10(ENT) XU905.27(!WE) ; supply symbol labelled SUPPLY ; also sheet 1,2,3,4,5,6,7,8,10,11
Unconnected: U901.11(QD) U901.12(QC) U901.15(RCO) U906.6(Q4) XU905.1(RDY/!B)

### Buses
OUT_SEG:OUT_SEG_A,OUT_SEG_B,OUT_SEG_C,OUT_SEG_D,OUT_SEG_DP,OUT_SEG_E,OUT_SEG_F,OUT_SEG_G
MAINBUS:MAINBUS_[0..7]